# EAGLE schematic warp-revB (EAGLE 9.4.2)

## Sheet 1 of 2
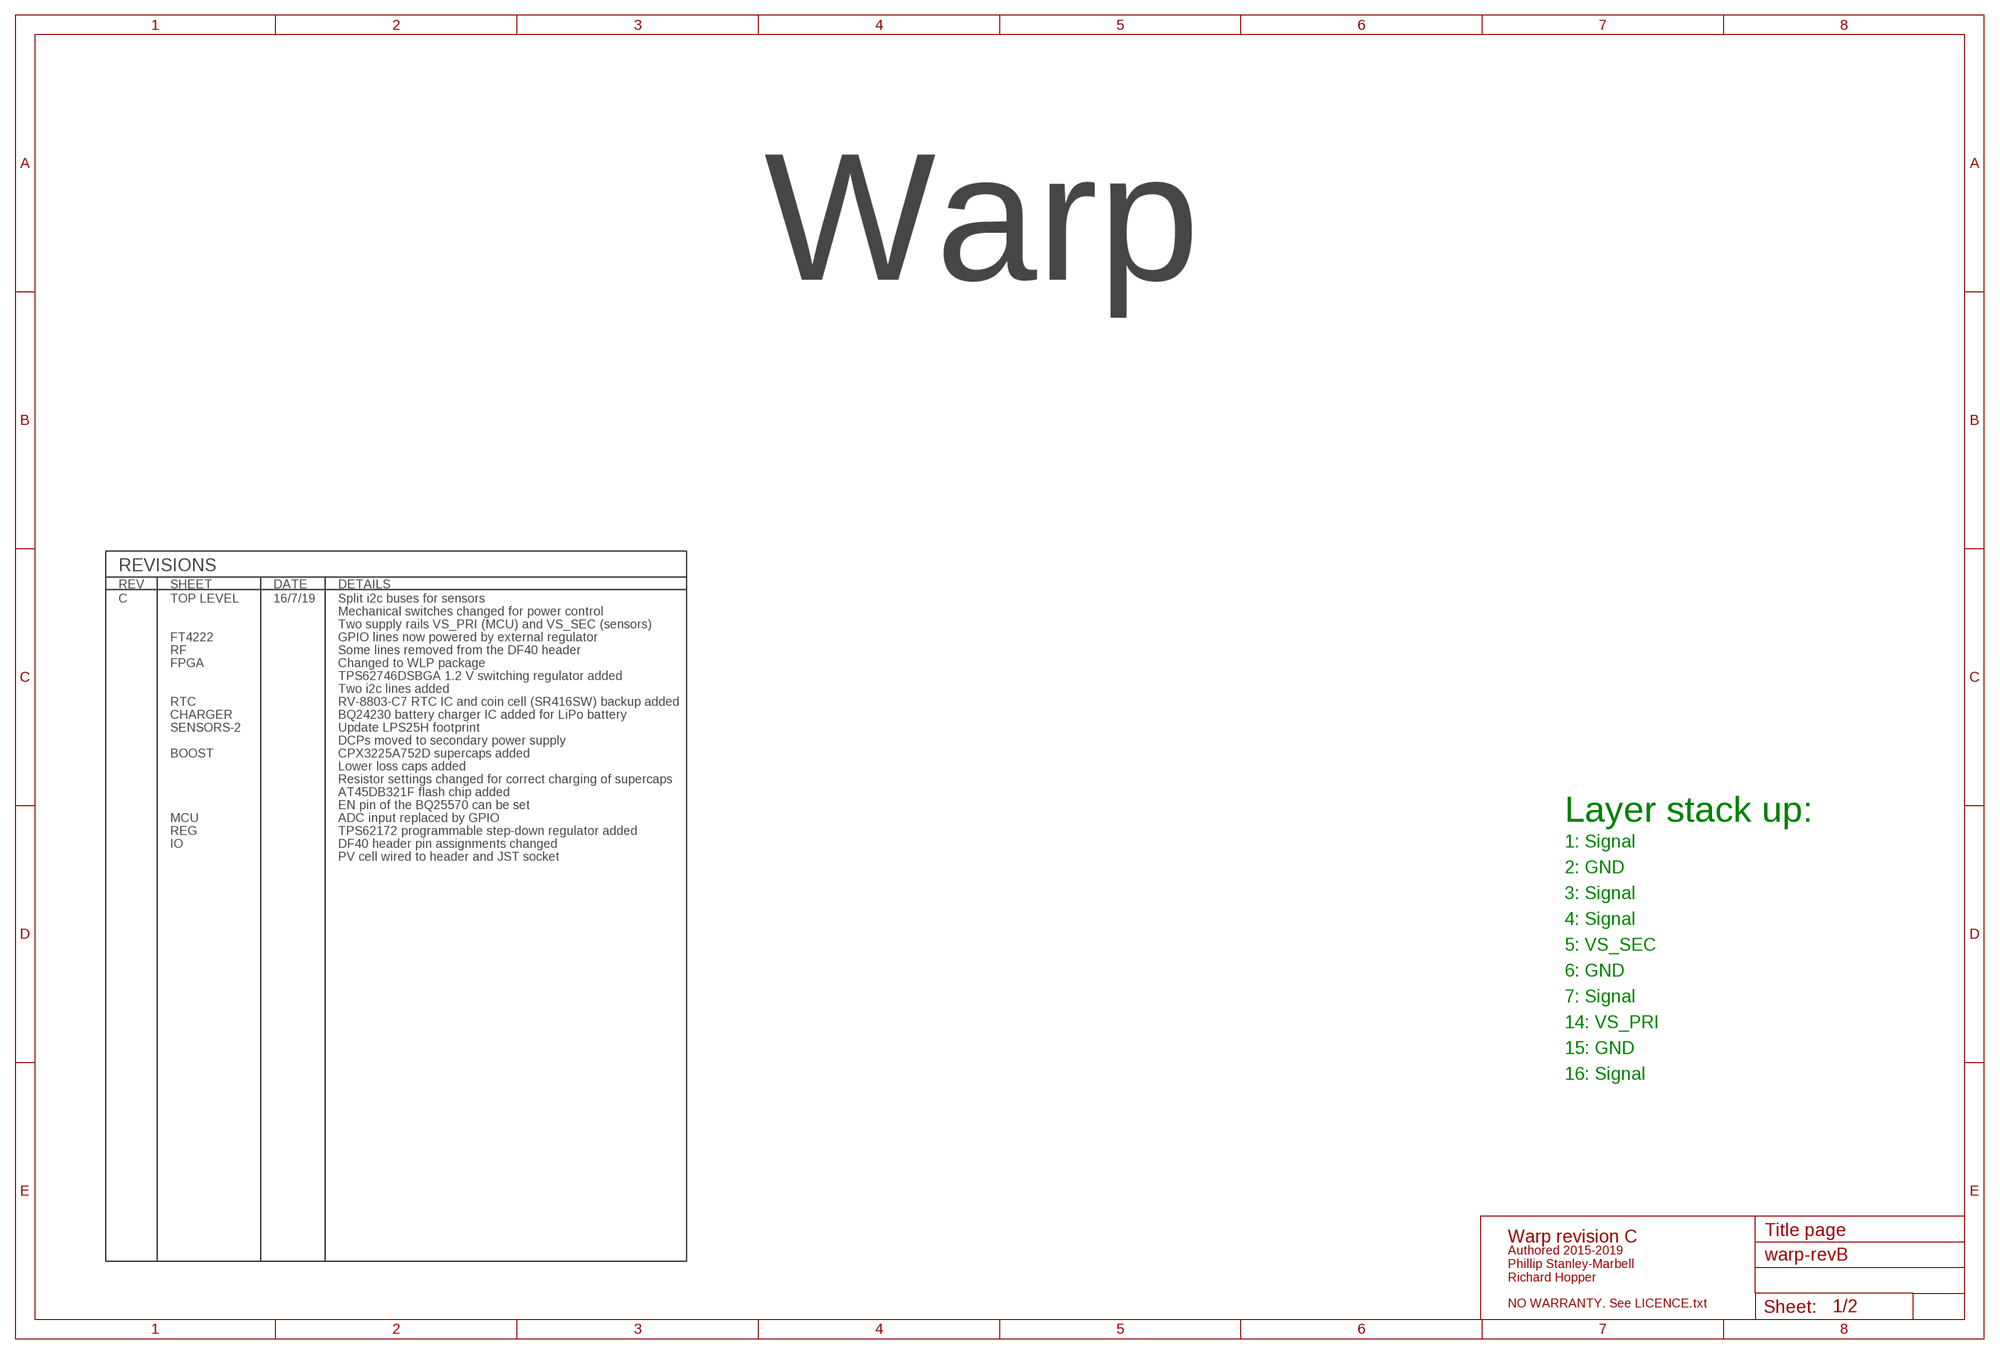
[diagram p0: schematic, sheet 1]

### Notes on the sheet
- Warp
- C | TOP LEVEL | 16/7/19 | Split i2c buses for sensors
- Mechanical switches changed for power control
- Two supply rails VS_PRI (MCU) and VS_SEC (sensors)
- FT4222 | GPIO lines now powered by external regulator
- RF | Some lines removed from the DF40 header
- FPGA | Changed to WLP package
- TPS62746DSBGA 1.2 V switching regulator added
- Two i2c lines added
- RTC | RV-8803-C7 RTC IC and coin cell (SR416SW) backup added
- CHARGER | BQ24230 battery charger IC added for LiPo battery
- SENSORS-2 | Update LPS25H footprint
- DCPs moved to secondary power supply
- BOOST | CPX3225A752D supercaps added
- Lower loss caps added
- Resistor settings changed for correct charging of supercaps
- AT45DB321F flash chip added
- EN pin of the BQ25570 can be set
- MCU | ADC input replaced by GPIO | Layer stack up:
- REG | TPS62172 programmable step-down regulator added
- IO | DF40 header pin assignments changed | 1: Signal
- PV cell wired to header and JST socket
- 2: GND
- 3: Signal
- 4: Signal
- 5: VS_SEC
- 6: GND
- 7: Signal
- 14: VS_PRI
- 15: GND
- 16: Signal
- Title page
- Warp revision C
- Authored 2015-2019
  Phillip Stanley-Marbell
  Richard Hopper
- NO WARRANTY. See LICENCE.txt

## Sheet 2 of 2
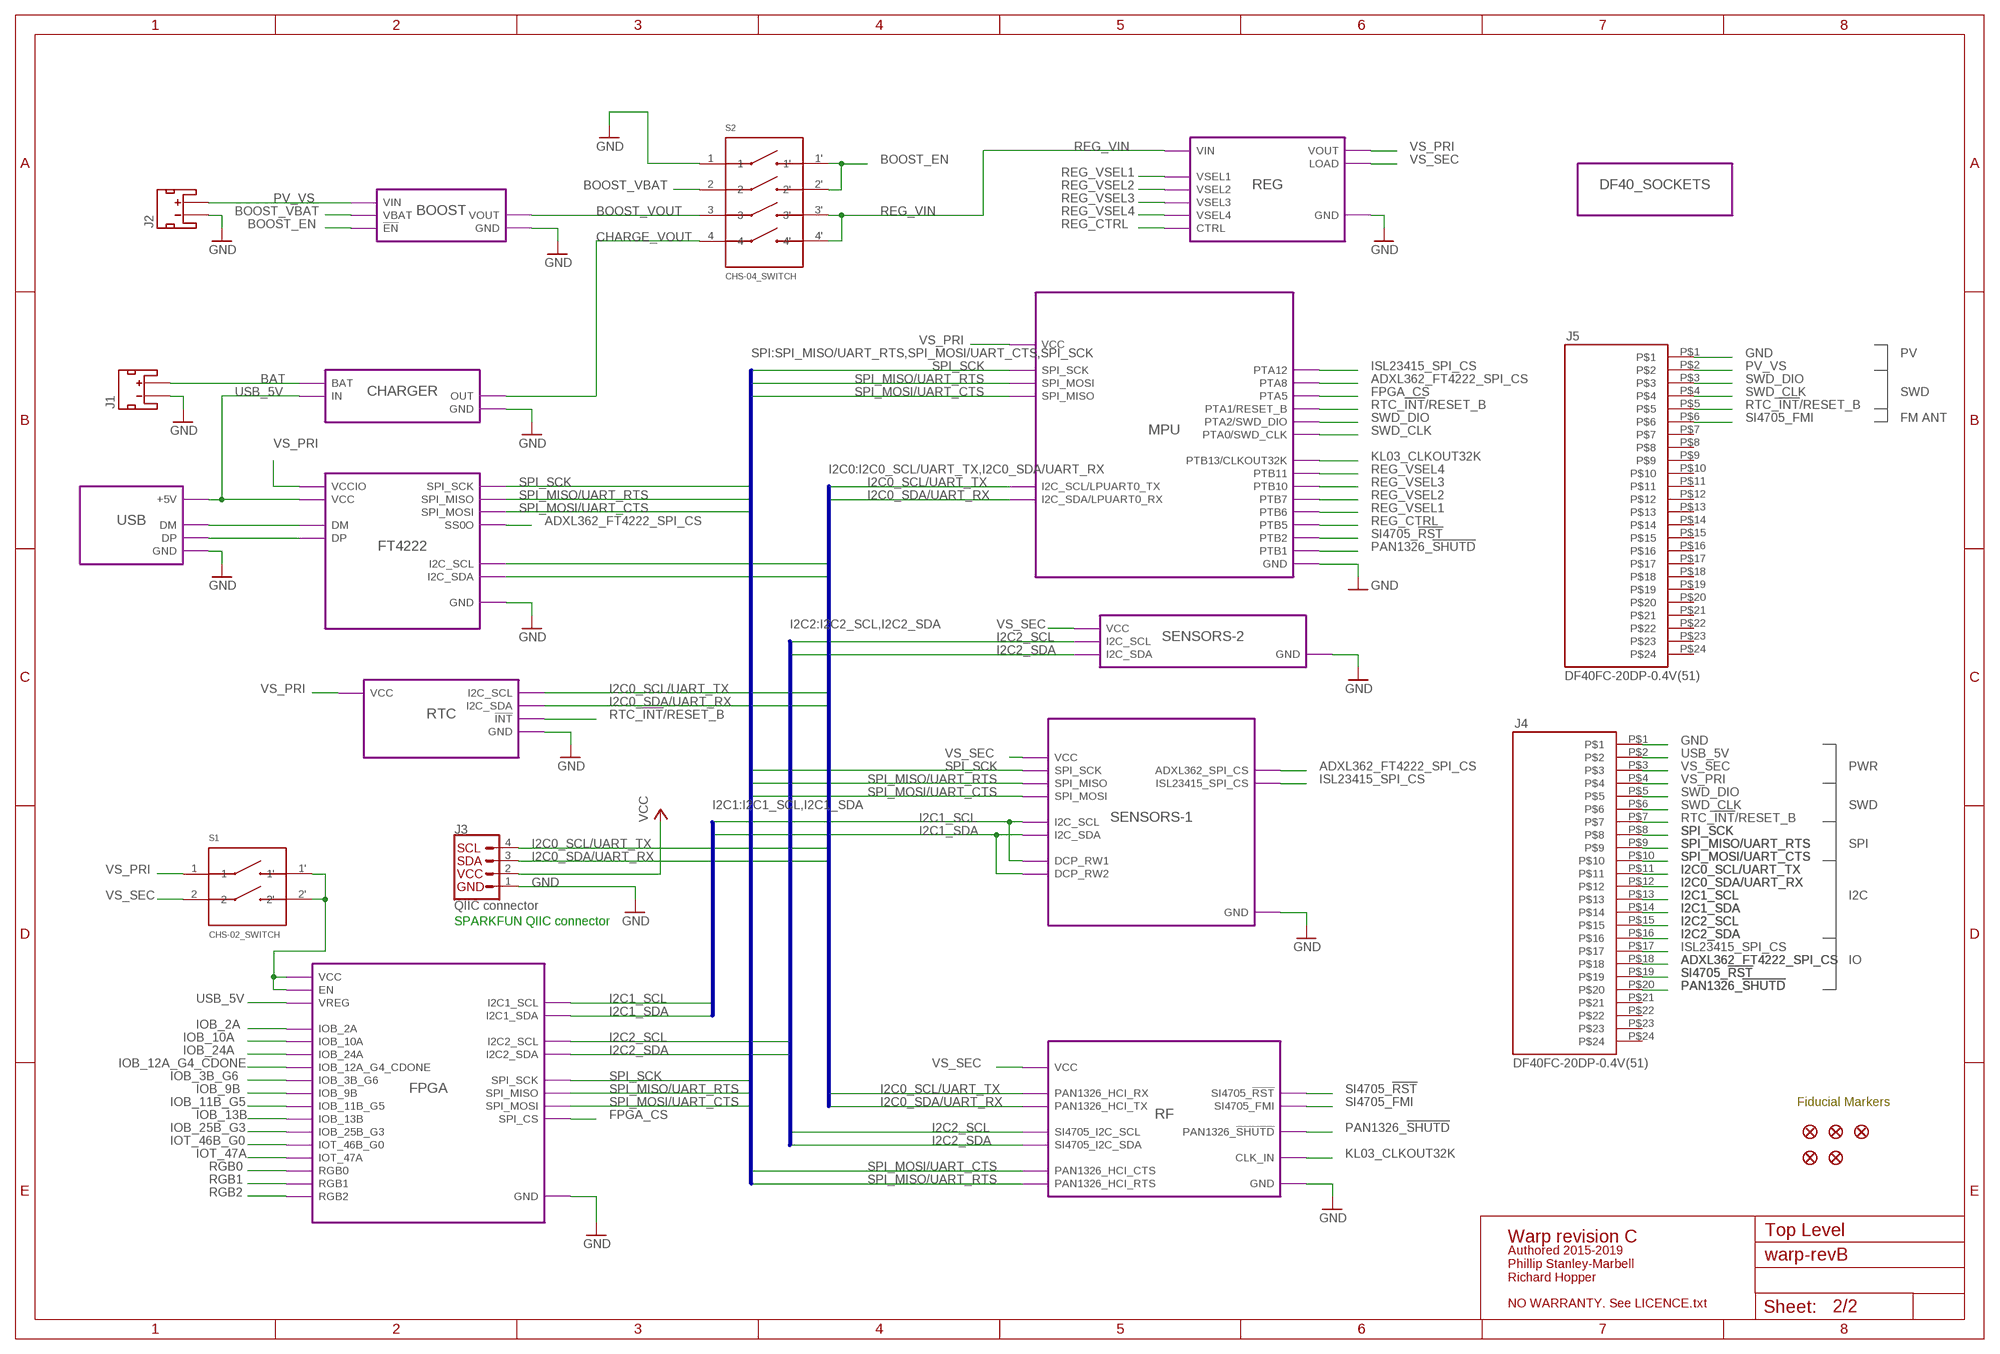
[diagram p1: schematic, sheet 2]

### Parts
FD1  FIDUCIAL1X2  [FIDUCIAL-1X2]
FD2  FIDUCIAL1X2  [FIDUCIAL-1X2]
FD3  FIDUCIAL1X2  [FIDUCIAL-1X2]
FD4  FIDUCIAL1X2  [FIDUCIAL-1X2]
FD5  FIDUCIAL1X2  [FIDUCIAL-1X2]
J1  JST_2MM_MALE  [JST-2-SMD]
J2  JST_2MM_MALE  [JST-2-SMD]
J3  QIIC connector  I2C_STANDARDJS-1MM  [1X04_1MM_RA]
J4  DF40FC-20DP-0.4V(51)  [DF40C-20DP-0.4V(51)]
J5  DF40FC-20DP-0.4V(51)  [DF40C-20DP-0.4V(51)]
S1  CHS-02_SWITCH  [CHS-02_SWITCH]
S2  CHS-04_SWITCH  [CHS-04_SWITCH]

### Module instances
BOOST = BOOSTER
MPU = MPU
REG = REG
RF = RF
SENSORS-1 = SENSORS-1
USB = USB
FPGA = FPGA
SENSORS-2 = SENSORS-2
RTC = RTC
CHARGER = CHARGER
FT4222 = FT4222
DF40_SOCKETS = DF40_SOCKETS

### Nets
ADXL362_FT4222_SPI_CS: J4.P$18 ; port SENSORS-1.ADXL362_SPI_CS MPU.PTA8 FT4222.SS0O
BAT: J1.2(+) ; port CHARGER.BAT
BOOST_EN: S2.1' S2.2' ; port BOOST.!EN!
BOOST_VBAT: S2.2 ; port BOOST.VBAT
BOOST_VOUT: S2.3 ; port BOOST.VOUT
CHARGE_VOUT: S2.4 ; port CHARGER.OUT
FPGA_CS: port FPGA.SPI_CS MPU.PTA5
FPGA_VS: S1.1' S1.2' ; port FPGA.VCC FPGA.EN
GND: J1.1(-) J2.1(-) J3.1(GND) J4.P$1 J5.P$1 S2.1 ; port REG.GND BOOST.GND USB.GND MPU.GND SENSORS-1.GND SENSORS-2.GND FPGA.GND RF.GND RTC.GND CHARGER.GND FT4222.GND
I2C0_SCL/UART_TX: J3.4(SCL) J4.P$11 ; port MPU.I2C_SCL/LPUART0_TX RTC.I2C_SCL RF.PAN1326_HCI_RX FT4222.I2C_SCL
I2C0_SDA/UART_RX: J3.3(SDA) J4.P$12 ; port MPU.I2C_SDA/LPUART0_RX RTC.I2C_SDA RF.PAN1326_HCI_TX FT4222.I2C_SDA
I2C1_SCL: J4.P$13 ; port FPGA.I2C1_SCL SENSORS-1.I2C_SCL SENSORS-1.DCP_RW1
I2C1_SDA: J4.P$14 ; port FPGA.I2C1_SDA SENSORS-1.I2C_SDA SENSORS-1.DCP_RW2
I2C2_SCL: J4.P$15 ; port FPGA.I2C2_SCL SENSORS-2.I2C_SCL RF.SI4705_I2C_SCL
I2C2_SDA: J4.P$16 ; port FPGA.I2C2_SDA SENSORS-2.I2C_SDA RF.SI4705_I2C_SDA
IOB_2A: port FPGA.IOB_2A
IOB_3B_G6: port FPGA.IOB_3B_G6
IOB_9B: port FPGA.IOB_9B
IOB_10A: port FPGA.IOB_10A
IOB_11B_G5: port FPGA.IOB_11B_G5
IOB_12A_G4_CDONE: port FPGA.IOB_12A_G4_CDONE
IOB_13B: port FPGA.IOB_13B
IOB_24A: port FPGA.IOB_24A
IOB_25B_G3: port FPGA.IOB_25B_G3
IOT_46B_G0: port FPGA.IOT_46B_G0
IOT_47A: port FPGA.IOT_47A
ISL23415_SPI_CS: J4.P$17 ; port SENSORS-1.ISL23415_SPI_CS MPU.PTA12
KL03_CLKOUT32K: port MPU.PTB13/CLKOUT32K RF.CLK_IN
N$1: port USB.DP FT4222.DP
N$2: port USB.DM FT4222.DM
PAN1326_!SHUTD: J4.P$20 ; port RF.PAN1326_!SHUTD! MPU.PTB1
PV_VS: J2.2(+) J5.P$2 ; port BOOST.VIN
REG_CTRL: port REG.CTRL MPU.PTB5
REG_VIN: S2.3' S2.4' ; port REG.VIN
REG_VSEL1: port REG.VSEL1 MPU.PTB6
REG_VSEL2: port REG.VSEL2 MPU.PTB7
REG_VSEL3: port REG.VSEL3 MPU.PTB10
REG_VSEL4: port REG.VSEL4 MPU.PTB11
RGB0: port FPGA.RGB0
RGB1: port FPGA.RGB1
RGB2: port FPGA.RGB2
RTC_!INT!/RESET_B: J4.P$7 J5.P$5 ; port MPU.PTA1/RESET_B RTC.!INT
SI4705_!RST!: J4.P$19 ; port RF.SI4705_!RST MPU.PTB2
SI4705_FMI: J5.P$6 ; port RF.SI4705_FMI
SPI_MISO/UART_RTS: J4.P$9 ; port MPU.SPI_MOSI SENSORS-1.SPI_MISO FPGA.SPI_MISO RF.PAN1326_HCI_RTS FT4222.SPI_MISO
SPI_MOSI/UART_CTS: J4.P$10 ; port SENSORS-1.SPI_MOSI MPU.SPI_MISO FPGA.SPI_MOSI RF.PAN1326_HCI_CTS FT4222.SPI_MOSI
SPI_SCK: J4.P$8 ; port MPU.SPI_SCK SENSORS-1.SPI_SCK FPGA.SPI_SCK FT4222.SPI_SCK
SWD_CLK: J4.P$6 J5.P$4 ; port MPU.PTA0/SWD_CLK
SWD_DIO: J4.P$5 J5.P$3 ; port MPU.PTA2/SWD_DIO
USB_5V: J4.P$2 ; port CHARGER.IN USB.+5V FT4222.VCC FPGA.VREG
VCC: J3.2(VCC)
VS_PRI: J4.P$4 S1.1 ; port MPU.VCC REG.VOUT RTC.VCC FT4222.VCCIO
VS_SEC: J4.P$3 S1.2 ; port SENSORS-1.VCC RF.VCC REG.LOAD SENSORS-2.VCC
Unconnected: J1.NC1(PAD1) J1.NC2(PAD2) J2.NC1(PAD1) J2.NC2(PAD2) J4.P$21 J4.P$22 J4.P$23 J4.P$24 J5.P$7 J5.P$8 J5.P$9 J5.P$10 J5.P$11 J5.P$12 J5.P$13 J5.P$14 J5.P$15 J5.P$16 J5.P$17 J5.P$18 J5.P$19 J5.P$20 J5.P$21 J5.P$22 J5.P$23 J5.P$24

### Buses
SPI:SPI_MISO/UART_RTS,SPI_MOSI/UART_CTS,SPI_SCK
I2C1:I2C1_SCL,I2C1_SDA
I2C2:I2C2_SCL,I2C2_SDA
I2C0:I2C0_SCL/UART_TX,I2C0_SDA/UART_RX

### Notes on the sheet
- PV
- SWD
- FM ANT
- PWR
- SWD
- SPI
- I2C
- SPARKFUN QIIC connector
- IO
- Fiducial Markers
- Top Level
- Warp revision C
- Authored 2015-2019
  Phillip Stanley-Marbell
  Richard Hopper
- NO WARRANTY. See LICENCE.txt

## Library data of the parts
FD1-FD5 = SparkFun-Aesthetics:FIDUCIAL: Fiducial Alignment Points Point-of-reference for pick-and-place machines and other optical instruments.
J1 J2 = SparkFun-Connectors:JST_2MM_MALE: JST 2MM MALE RA CONNECTOR Two pin, compact surface mount connector. Commonly used as a battery input connection point. We really like the solid locking feeling and high current rating on these small connectors. We use these all the time as battery connectors. Mates to single-cell LiPo batteries. Here is the connector we sell at SparkFun: JST Right Angle Connector - White <https://www.sparkfun.com/products/8612> (PRT-08612) Datasheet <http://www.sparkfun.com/datasheets/Prototyping/Connectors/JST-Horizontal.pdf> It was used on these SparkFun products: SparkFun MOSFET Power Controller <https://www.sparkfun.com/products/11214> (PRT-11214) SparkFun Battery Babysitter - LiPo Battery Manager <https://www.sparkfun.com/products/13777> (PRT-13777) And many, many others that required a lipo battery connection.; PROD_ID: CONN-11443; SF_ID: PRT-08612
J3 = SparkX:I2C_STANDARD: SparkFun I2C Standard Pinout Header SparkFun has standardized on a pinout for all I2C based sensor breakouts. This pinout allows I2C boards to be plugged directly into the headers on Arduino Uno compatible boards, and to be daisy chained easily. Example SparkFun Products: SparkFun Atmospheric Sensor Breakout - BME280 <https://www.sparkfun.com/products/13676> SparkFun Altitude/Pressure Sensor Breakout - MPL3115A2 <https://www.sparkfun.com/products/11084> SparkFun TOF Range Finder Sensor - VL6180 <https://www.sparkfun.com/products/12785>
J4 J5 = DF40FC-20DP-0.4V(51):DF40FC-20DP-0.4V(51): DF40C-20DP-0.4V(51) Pins 21, 22, 23, and 24 (at the corners of the package) are not supposed to be used electrically. They have slightly wider pads. NOTE: The receptacles do not have connectors to the signals from these pins!
S1 = CHS_SWITCH:CHS-02_SWITCH
S2 = CHS_SWITCH:CHS-04_SWITCH

## Module BOOSTER
Ports: VIN(in) VOUT(out) !EN!(in) VBAT(pas) GND(pwr)
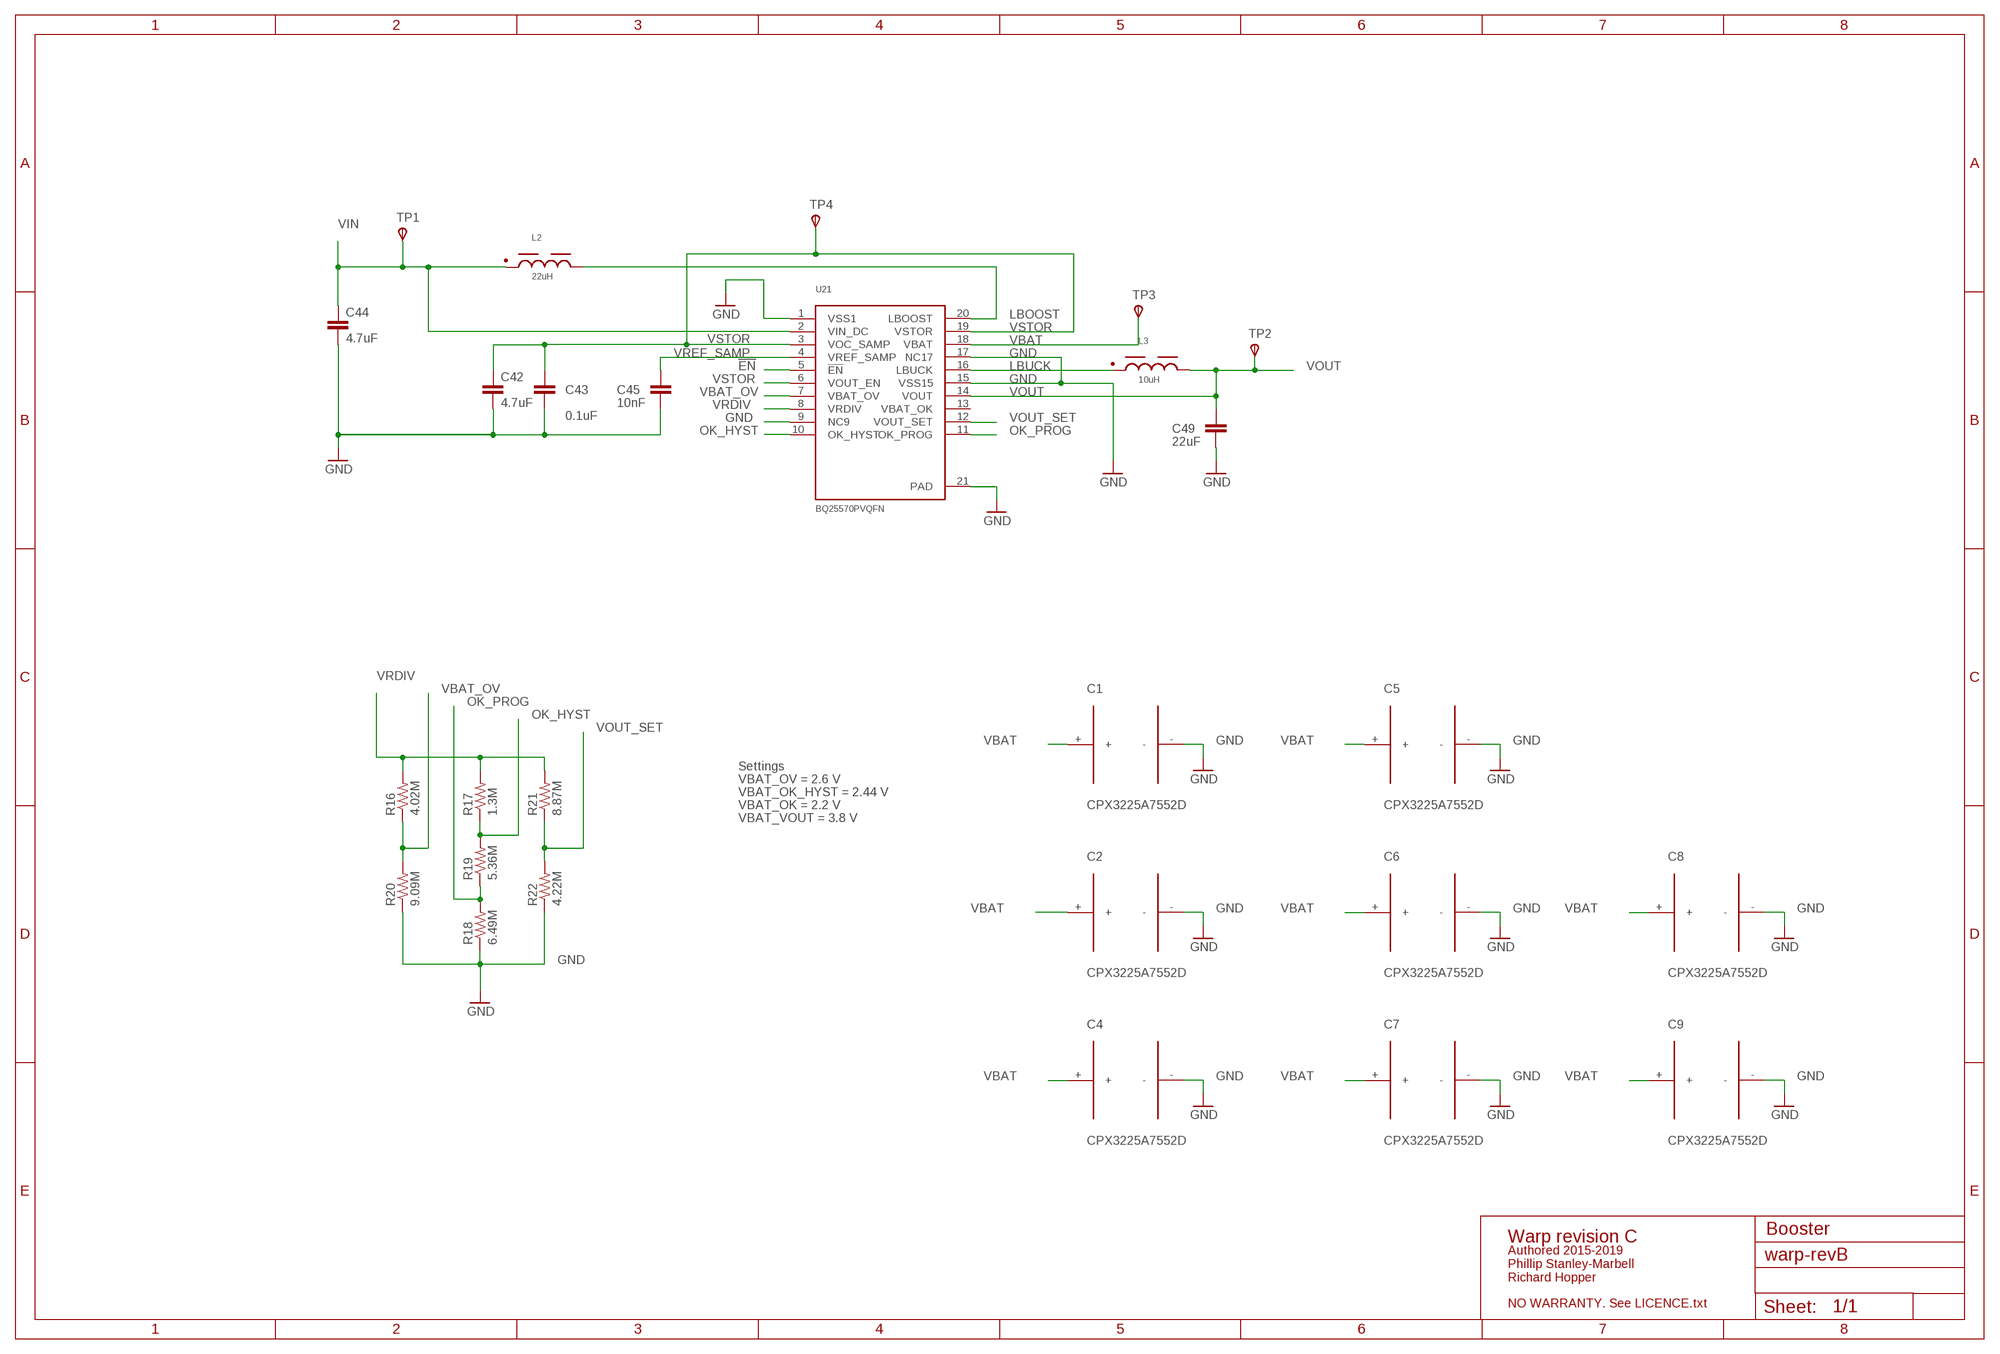
[diagram p2: schematic, module BOOSTER, sheet 1]

### Parts
C1  CPX3225A7552D  [CPX3225A752D]
C2  CPX3225A7552D  [CPX3225A752D]
C4  CPX3225A7552D  [CPX3225A752D]
C5  CPX3225A7552D  [CPX3225A752D]
C6  CPX3225A7552D  [CPX3225A752D]
C7  CPX3225A7552D  [CPX3225A752D]
C8  CPX3225A7552D  [CPX3225A752D]
C9  CPX3225A7552D  [CPX3225A752D]
C42  4.7uF  CAP0805  [0805]
C43  0.1uF  CAP0603-CAP  [0603-CAP]
C44  4.7uF  CAP0805  [0805]
C45  10nF  CAP0603-CAP  [0603-CAP]
C49  22uF  CAP0805  [0805]
L2  22uH  WE-TPC_3816_744031220  [WE-TPC_3816]
L3  10uH  WE-TPC_2813_744029100  [WE-TPC_2811/2813_OLD]
R16  4.02M  RESISTOR0402-RES  [0402-RES]
R17  1.3M  RESISTOR0402-RES  [0402-RES]
R18  6.49M  RESISTOR0402-RES  [0402-RES]
R19  5.36M  RESISTOR0402-RES  [0402-RES]
R20  9.09M  RESISTOR0402-RES  [0402-RES]
R21  8.87M  RESISTOR0402-RES  [0402-RES]
R22  4.22M  RESISTOR0402-RES  [0402-RES]
TP1  TPSTP06R  [TP06R]
TP2  TPSTP06R  [TP06R]
TP3  TPSTP06R  [TP06R]
TP4  TPSTP06R  [TP06R]
U21  BQ25570PVQFN  [BQ25570]

### Nets
!EN!: U21.5(!EN)
GND: C1.- C2.- C4.- C5.- C6.- C7.- C8.- C9.- C42.2 C43.2 C44.2 C45.2 C49.2 R18.1 R20.1 R22.1 U21.1(VSS1) U21.9(NC9) U21.15(VSS15) U21.17(NC17) U21.21(PAD)
LBOOST: L2.2 U21.20(LBOOST)
LBUCK: L3.1 U21.16(LBUCK)
OK_HYST: R17.1 R19.2 U21.10(OK_HYST)
OK_PROG: R18.2 R19.1 U21.11(OK_PROG)
VBAT: C1.+ C2.+ C4.+ C5.+ C6.+ C7.+ C8.+ C9.+ TP3.TP(PP) U21.18(VBAT)
VBAT_OV: R16.1 R20.2 U21.7(VBAT_OV)
VIN: C44.1 L2.1 TP1.TP(PP) U21.2(VIN_DC)
VOUT: C49.1 L3.2 TP2.TP(PP) U21.14(VOUT)
VOUT_SET: R21.1 R22.2 U21.12(VOUT_SET)
VRDIV: R16.2 R17.2 R21.2 U21.8(VRDIV)
VREF_SAMP: C45.1 U21.4(VREF_SAMP)
VSTOR: C42.1 C43.1 TP4.TP(PP) U21.3(VOC_SAMP) U21.6(VOUT_EN) U21.19(VSTOR)
Unconnected: U21.13(VBAT_OK)

### Notes on the sheet
- Settings
- VBAT_OV = 2.6 V
- VBAT_OK_HYST = 2.44 V
- VBAT_OK = 2.2 V
- VBAT_VOUT = 3.8 V
- Booster
- Warp revision C
- Authored 2015-2019
  Phillip Stanley-Marbell
  Richard Hopper
- NO WARRANTY. See LICENCE.txt

### Library data of the parts
C1 C2 C4-C8 = CPX3225A752D:CPX3225A7552D: CPX3225A eectric double layer capacitor
C9 = CPX3225A752D:CPX3225A7552D: CPX3225A eectric double layer capacitor; SPICEPREFIX: C
C42 C44 = SparkFun-Passives:CAP: Capacitor Standard 0603 ceramic capacitor, and 0.1" leaded capacitor.; PN: C0805C475K9RACTU
C43 = SparkFun-Passives:CAP: Capacitor Standard 0603 ceramic capacitor, and 0.1" leaded capacitor.; PN: 02016D104KAT2A
C45 = SparkFun-Passives:CAP: Capacitor Standard 0603 ceramic capacitor, and 0.1" leaded capacitor.; PN: GRM188R71H103KA01D
C49 = SparkFun-Passives:CAP: Capacitor Standard 0603 ceramic capacitor, and 0.1" leaded capacitor.; PN: JMK212BJ226KG-T
L2 = EMCComponents (rev19c):WE-TPC_3816: SMD Shielded Tiny Power Inductor Characteristics Extremely flat power inductor High current capability Magnetically shielded which results in a low leakage field Operating temperature: –40 °C to +125 °C Applications Portable power like PDA, digital camera, PCMCIA cards and displays DC/DC converter Embedded PC Mobile data gathering, telemetric <http://katalog.we-online.de/media/images/v2/WE-TPC_Gruppe_2.jpg> Details see: http://katalog.we-online.de/en/pbs/WE-TPC? Updated by Dan Xu 2014-07-11 2014 (C) Wurth Elektronik; WE-NUMBER: 744031220/22uH
L3 = EMCComponents (rev19c):WE-TPC_2813: SMD Shielded Tiny Power Inductor Characteristics Extremely flat power inductor High current capability Magnetically shielded which results in a low leakage field Operating temperature: –40 °C to +125 °C Applications Portable power like PDA, digital camera, PCMCIA cards and displays DC/DC converter Embedded PC Mobile data gathering, telemetric <http://katalog.we-online.de/media/images/v2/WE-TPC_Gruppe_2.jpg> Details see: http://katalog.we-online.de/en/pbs/WE-TPC? Updated by Dan Xu 2014-07-11 2014 (C) Wurth Elektronik; WE-NUMBER: 744029100/10uH
R16-R22 = SparkFun-Passives:RESISTOR: Resistor Basic schematic elements and footprints for 0603, 1206, and PTH resistors.
TP1-TP4 = testpad:TPS: TEST PIN
U21 = BQ25570:BQ25570

## Module MPU
Ports: GND(pwr) VCC(io) PTB1(io) PTB2(io) PTB5(io) PTB6(io) PTB7(io) PTA8(io) PTA5(io) PTB10(io) PTA12(io) PTB11(io) PTB13/CLKOUT32K(io) SPI_SCK(out) SPI_MISO(in) SPI_MOSI(out) I2C_SCL/LPUART0_TX(out) I2C_SDA/LPUART0_RX(io) PTA1/RESET_B(io) PTA2/SWD_DIO(io) PTA0/SWD_CLK(io)
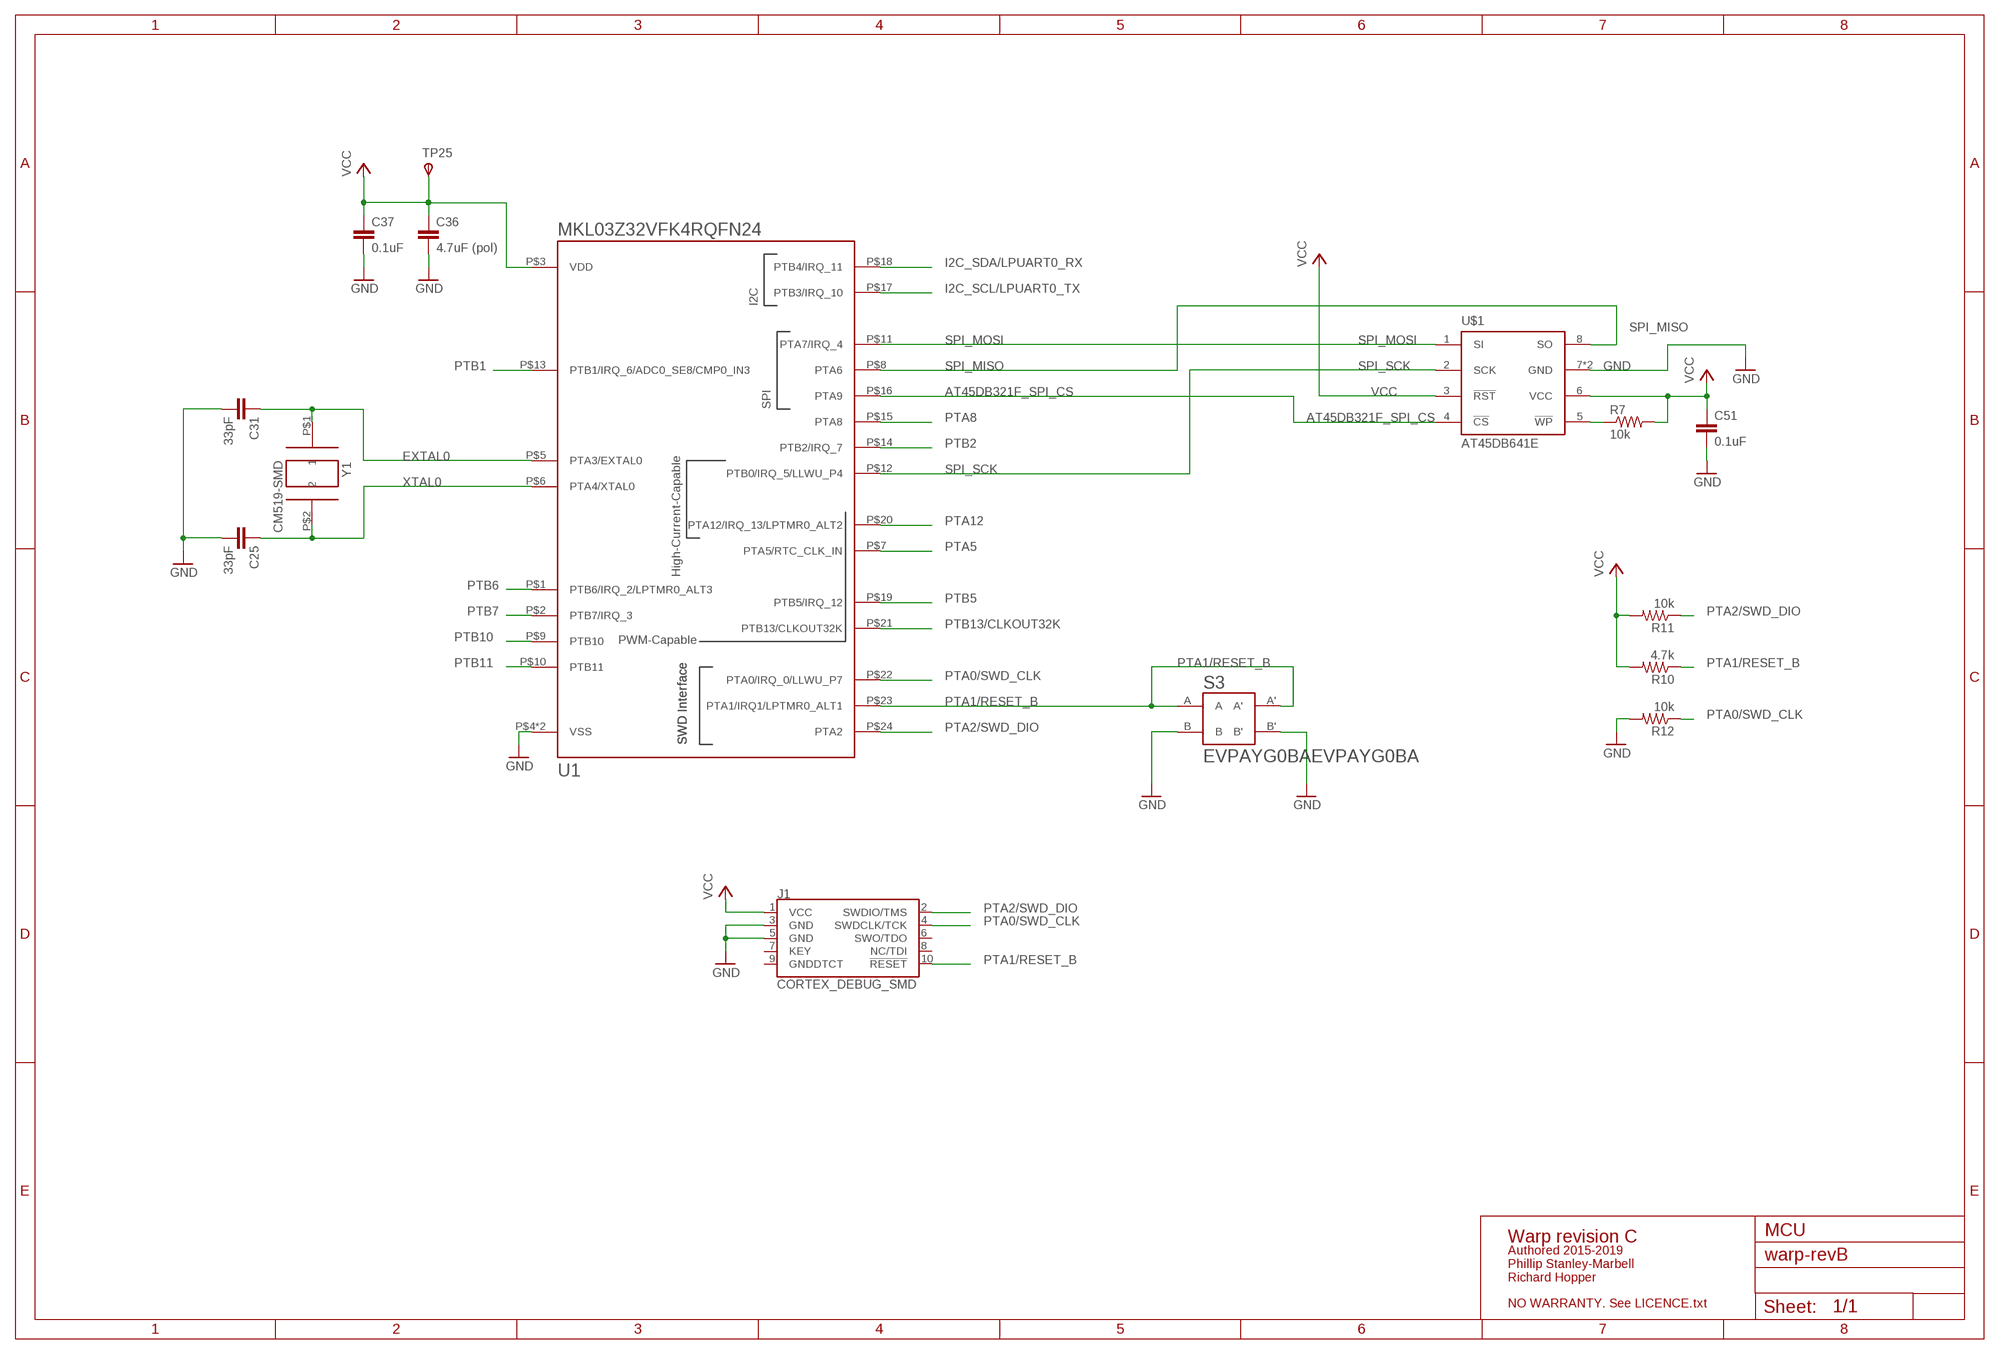
[diagram p3: schematic, module MPU, sheet 1]

### Parts
C25  33pF  CAP0402-CAP  [0402-CAP]
C31  33pF  CAP0402-CAP  [0402-CAP]
C36  4.7uF (pol)  CAP0402-CAP  [0402-CAP]
C37  0.1uF  CAP0402-CAP  [0402-CAP]
C51  0.1uF  CAP0402-CAP  [0402-CAP]
J1  CORTEX_DEBUG_SMD  [SAMTECH_FTSH-105-01]
R7  10k  RESISTOR0402-RES  [0402-RES]
R10  4.7k  RESISTOR0402-RES  [0402-RES]
R11  10k  RESISTOR0402-RES  [0402-RES]
R12  10k  RESISTOR0402-RES  [0402-RES]
S3  EVPAYG0BAEVPAYG0BA  [EVPAYG0BA]
TP25  TPSTP06R  [TP06R]
U1  MKL03Z32VFK4RQFN24  [MKL03Z32VFK4R]
U$1  AT45DB641E  [UDFN]
Y1  CM519-SMD  [CM519]

### Nets
AT45DB321F_SPI_CS: U1.P$16(PTA9) U$1.4(!CS!)
EXTAL0: C31.1 U1.P$5(PTA3/EXTAL0) Y1.P$1
GND: C25.2 C31.2 C51.2 J1.3(GND) J1.5(GND) R12.2 S3.B S3.B' U1.P$4(VSS) U1.P$PAD(VSS) U$1.7(GND) U$1.9(GND)
I2C_SCL/LPUART0_TX: U1.P$17(PTB3/IRQ_10)
I2C_SDA/LPUART0_RX: U1.P$18(PTB4/IRQ_11)
N$4: R7.1 U$1.5(!WP!)
N$5: C37.2 ; supply symbol labelled GND
N$6: C36.2 ; supply symbol labelled GND
PTA0/SWD_CLK: J1.4(SWDCLK/TCK) R12.1 U1.P$22(PTA0/IRQ_0/LLWU_P7)
PTA1/RESET_B: J1.10(!RESET) R10.1 S3.A S3.A' U1.P$23(PTA1/IRQ1/LPTMR0_ALT1)
PTA2/SWD_DIO: J1.2(SWDIO/TMS) R11.1 U1.P$24(PTA2)
PTA5: U1.P$7(PTA5/RTC_CLK_IN)
PTA8: U1.P$15(PTA8)
PTA12: U1.P$20(PTA12/IRQ_13/LPTMR0_ALT2)
PTB1: U1.P$13(PTB1/IRQ_6/ADC0_SE8/CMP0_IN3)
PTB2: U1.P$14(PTB2/IRQ_7)
PTB5: U1.P$19(PTB5/IRQ_12)
PTB6: U1.P$1(PTB6/IRQ_2/LPTMR0_ALT3)
PTB7: U1.P$2(PTB7/IRQ_3)
PTB10: U1.P$9(PTB10)
PTB11: U1.P$10(PTB11)
PTB13/CLKOUT32K: U1.P$21(PTB13/CLKOUT32K)
SPI_MISO: U1.P$8(PTA6) U$1.8(SO)
SPI_MOSI: U1.P$11(PTA7/IRQ_4) U$1.1(SI)
SPI_SCK: U1.P$12(PTB0/IRQ_5/LLWU_P4) U$1.2(SCK)
VCC: C36.1 C37.1 C51.1 J1.1(VCC) R7.2 R10.2 R11.2 TP25.TP(PP) U1.P$3(VDD) U$1.3(!RST!) U$1.6(VCC)
XTAL0: C25.1 U1.P$6(PTA4/XTAL0) Y1.P$2
Unconnected: J1.6(SWO/TDO) J1.7(KEY) J1.8(NC/TDI) J1.9(GNDDTCT)

### Notes on the sheet
- MCU
- Warp revision C
- Authored 2015-2019
  Phillip Stanley-Marbell
  Richard Hopper
- NO WARRANTY. See LICENCE.txt

### Library data of the parts
C25 C31 C36 C37 C51 = SparkFun-Passives:CAP: Capacitor Standard 0603 ceramic capacitor, and 0.1" leaded capacitor.
J1 = SparkFun-Connectors:CORTEX_DEBUG: Cortex Debug Connector - 10 pin Supports JTAG debug, Serial Wire debug, and Serial Wire Viewer. PTH and SMD connector options available. General Connector Information <http://infocenter.arm.com/help/topic/com.arm.doc.faqs/attached/13634/cortex_debug_connectors.pdf> Products: PTH Connector <http://www.digikey.com/product-detail/en/cnc-tech/3220-10-0100-00/1175-1627-ND/3883661> -via Digi-Key SparkFun PSoc <https://www.sparkfun.com/products/13229> SparkFun T <https://www.sparkfun.com/products/13810>
R7 R10-R12 = SparkFun-Passives:RESISTOR: Resistor Basic schematic elements and footprints for 0603, 1206, and PTH resistors.
S3 = EVPAYG0BA:EVPAYG0BA
TP25 = testpad:TPS: TEST PIN
U1 = MKL03Z32VFK4R:MKL03Z32VFK4R: Kinetis KL03 32 KB Flash, 48 MHz Cortex-M0+ Microcontroller, in 24 pin QFN package (MKL03Z32VFK4R). The package for the 20 pin WLCSP (MKL03Z32CAF4R) is also in the library due to historical reasons. Can't yet figure out how to remove it.
U$1 = AT45D_Flash:AT45DB641E: 64-Mbit DataFlash (with Extra 2-Mbits), 1.7V Minimum SPI Serial Flash Memory
Y1 = CM519:CM519

## Module REG
Ports: GND(pwr) VIN(pwr) VOUT(pwr) LOAD(pwr) CTRL(in) VSEL1(in) VSEL2(in) VSEL3(in) VSEL4(in)
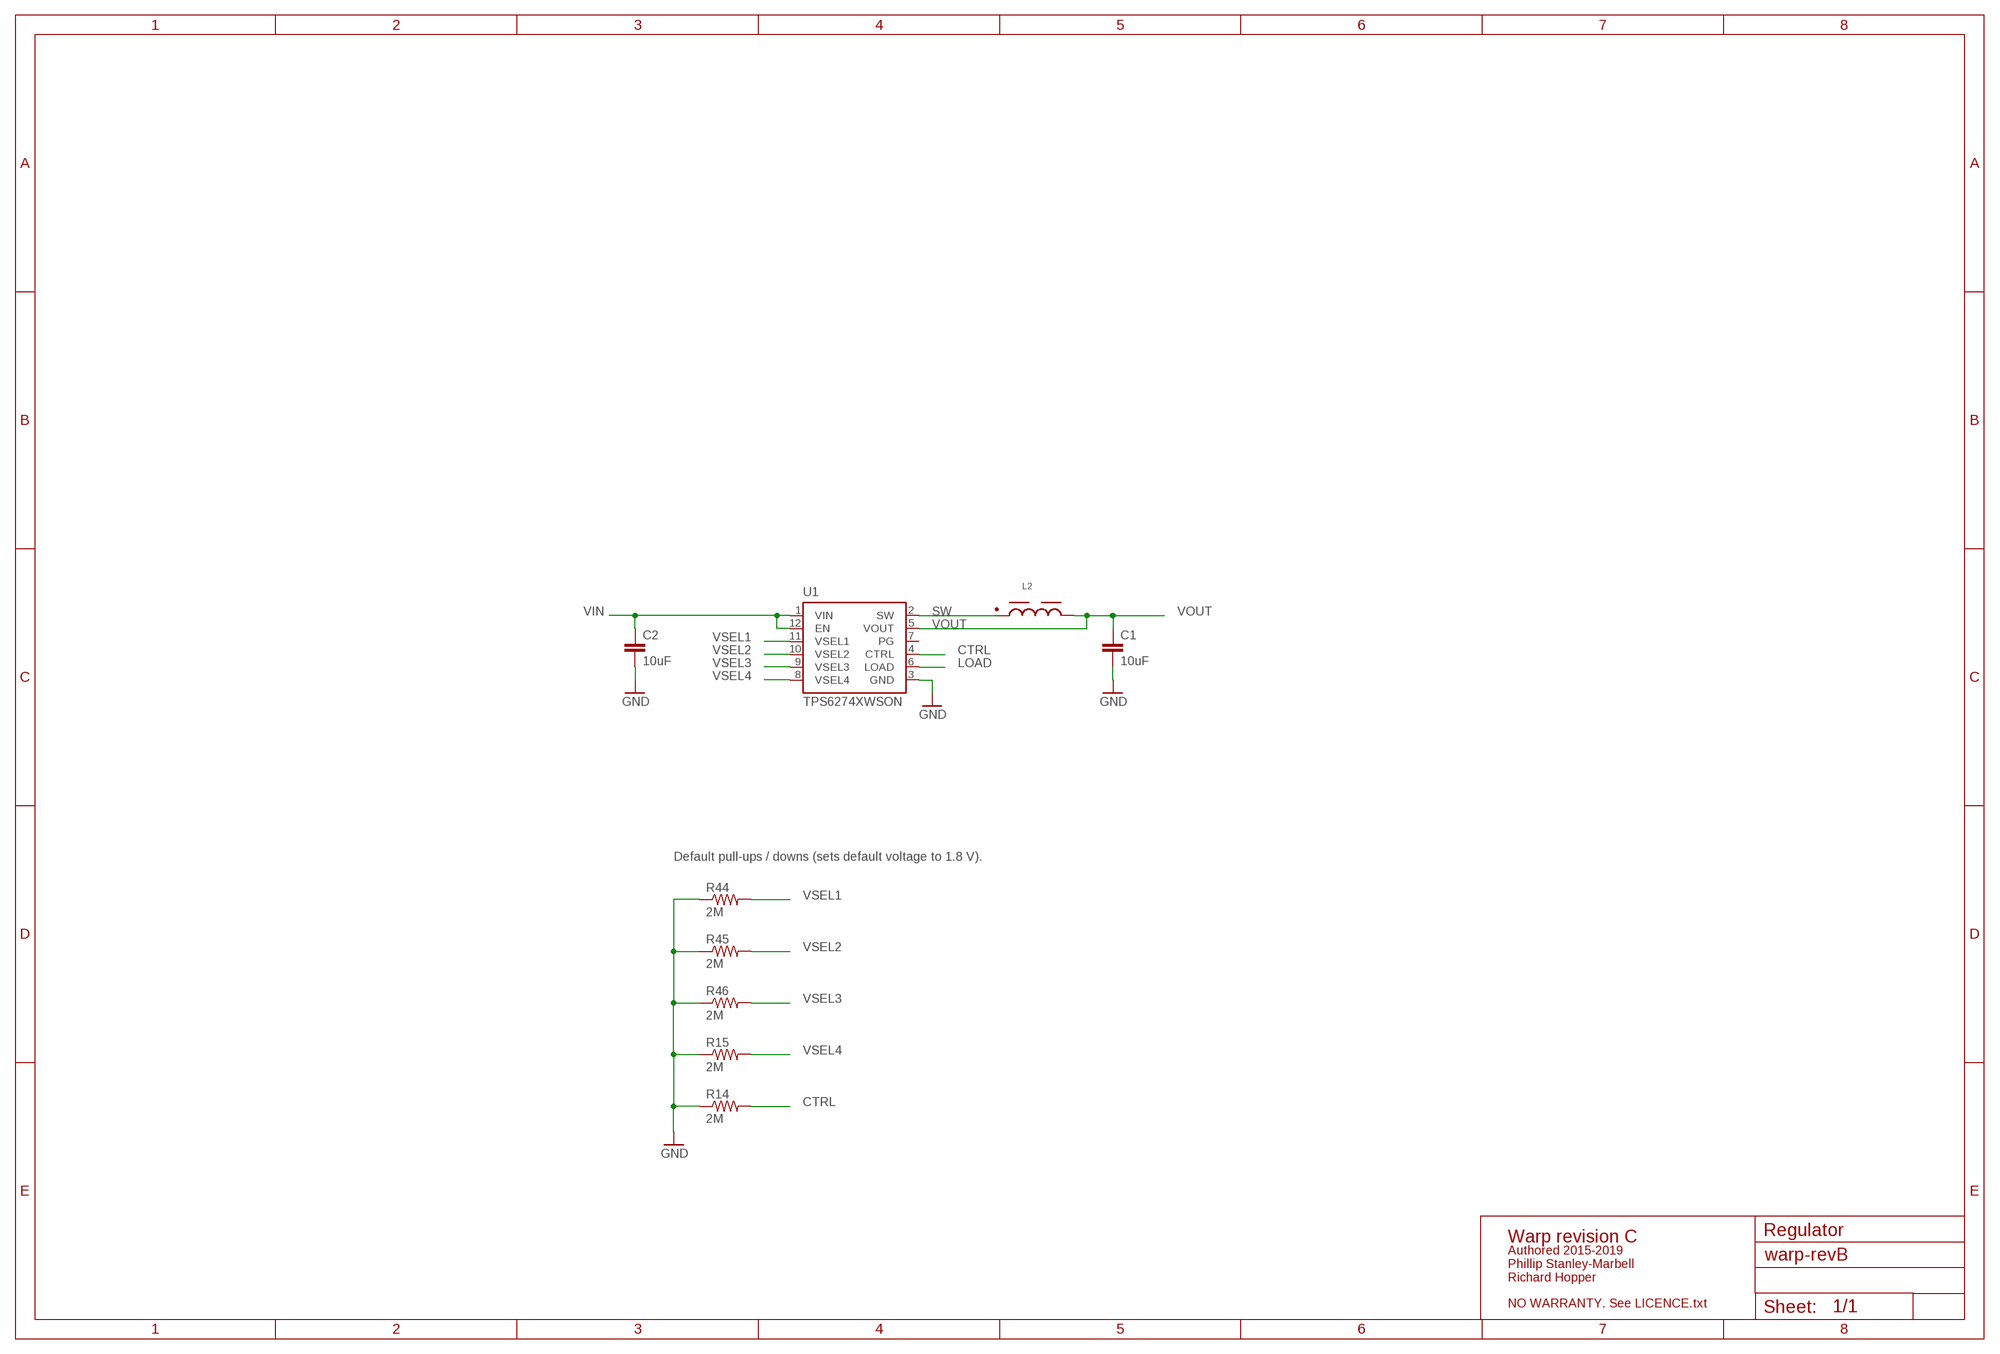
[diagram p4: schematic, module REG, sheet 1]

### Parts
C1  10uF  CAP0805  [0805]
C2  10uF  CAP0805  [0805]
L2  WE-TPC_2828_744025002  [WE-TPC_2828_OLD]
R14  2M  RESISTOR0402-RES  [0402-RES]
R15  2M  RESISTOR0402-RES  [0402-RES]
R44  2M  RESISTOR0402-RES  [0402-RES]
R45  2M  RESISTOR0402-RES  [0402-RES]
R46  2M  RESISTOR0402-RES  [0402-RES]
U1  TPS6274XWSON  [WSON-12]

### Nets
CTRL: R14.2 U1.4(CTRL)
GND: C1.2 C2.2 R14.1 R15.1 R44.1 R45.1 R46.1 U1.3(GND)
LOAD: U1.6(LOAD)
SW: L2.1 U1.2(SW)
VIN: C2.1 U1.1(VIN) U1.12(EN)
VOUT: C1.1 L2.2 U1.5(VOUT)
VSEL1: R44.2 U1.11(VSEL1)
VSEL2: R45.2 U1.10(VSEL2)
VSEL3: R46.2 U1.9(VSEL3)
VSEL4: R15.2 U1.8(VSEL4)
Unconnected: U1.7(PG)

### Notes on the sheet
- Default pull-ups / downs (sets default voltage to 1.8 V).
- Regulator
- Warp revision C
- Authored 2015-2019
  Phillip Stanley-Marbell
  Richard Hopper
- NO WARRANTY. See LICENCE.txt

### Library data of the parts
C1 C2 = SparkFun-Passives:CAP: Capacitor Standard 0603 ceramic capacitor, and 0.1" leaded capacitor.
L2 = EMCComponents (rev19c):WE-TPC_2828: SMD Shielded Tiny Power Inductor Characteristics Extremely flat power inductor High current capability Magnetically shielded which results in a low leakage field Operating temperature: –40 °C to +125 °C Applications Portable power like PDA, digital camera, PCMCIA cards and displays DC/DC converter Embedded PC Mobile data gathering, telemetric <http://katalog.we-online.de/media/images/v2/WE-TPC_Gruppe_2.jpg> Details see: http://katalog.we-online.de/en/pbs/WE-TPC? Updated by Dan Xu 2014-07-11 2014 (C) Wurth Elektronik; WE-NUMBER: 744025002/2,2uH
R14 R15 R44-R46 = SparkFun-Passives:RESISTOR: Resistor Basic schematic elements and footprints for 0603, 1206, and PTH resistors.
U1 = TPS6274x:TPS6274X

## Module RF
Ports: GND(pwr) VCC(pwr) PAN1326_!SHUTD!(in) SI4705_!RST(in) CLK_IN(in) SI4705_I2C_SCL(in) SI4705_I2C_SDA(io) PAN1326_HCI_RX(in) PAN1326_HCI_TX(out) PAN1326_HCI_CTS(io) PAN1326_HCI_RTS(io) SI4705_FMI(in)
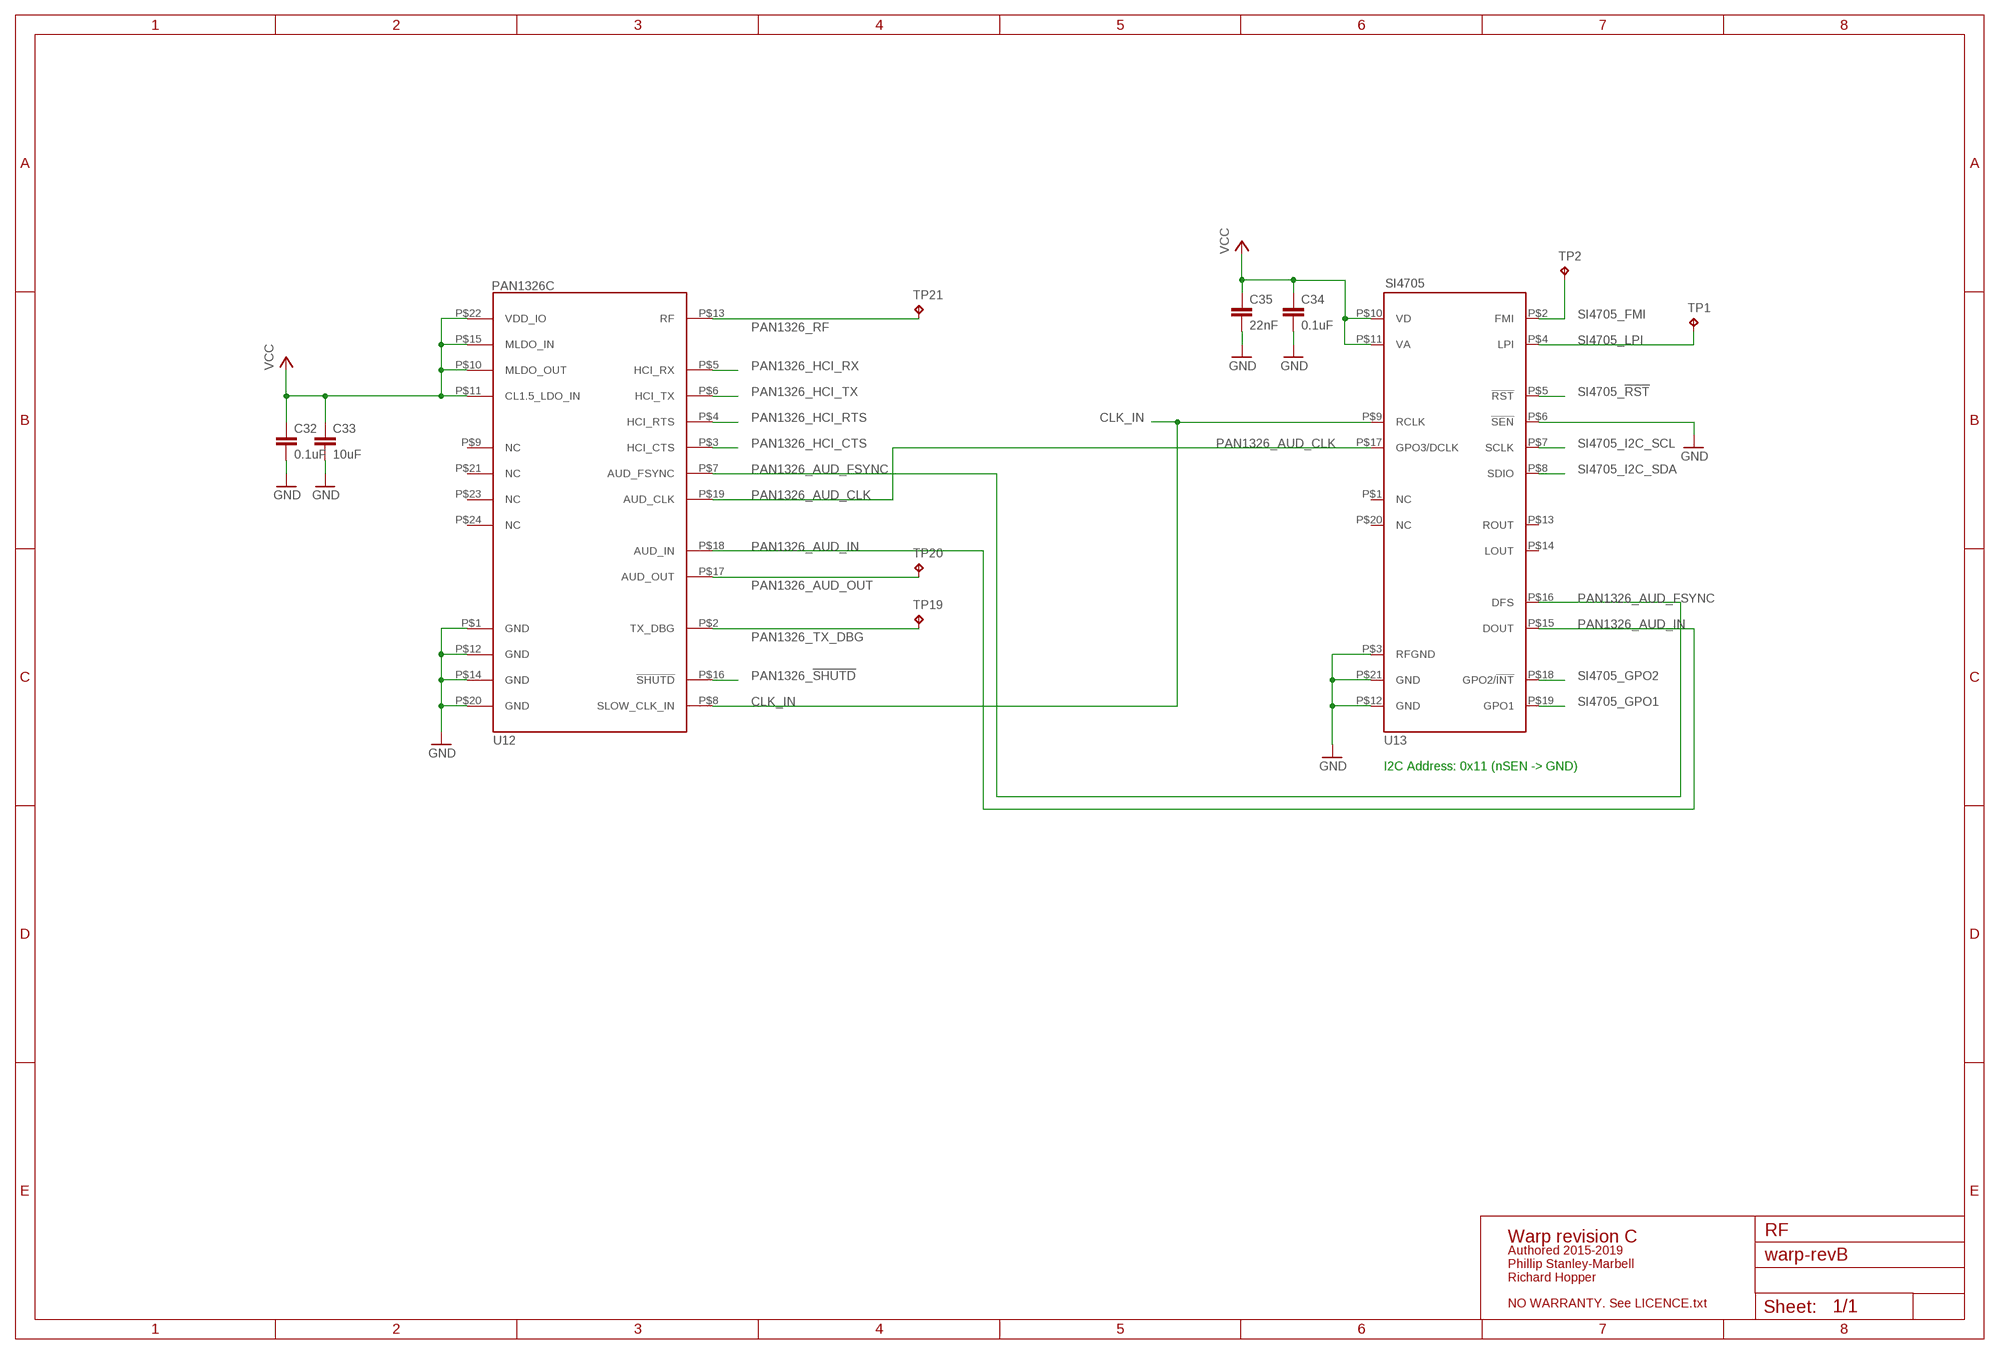
[diagram p5: schematic, module RF, sheet 1]

### Parts
C32  0.1uF  CAP0402-CAP  [0402-CAP]
C33  10uF  CAP0402-CAP  [0402-CAP]
C34  0.1uF  CAP0402-CAP  [0402-CAP]
C35  22nF  CAP0402-CAP  [0402-CAP]
TP1  TPTP06R  [TP06R]
TP2  TPTP06R  [TP06R]
TP19  TPTP06R  [TP06R]
TP20  TPTP06R  [TP06R]
TP21  TPTP06R  [TP06R]
U12  PAN1326C  PAN1326B  [PAN1326B]
U13  SI4705  [SI4705]

### Nets
CLK_IN: U12.P$8(SLOW_CLK_IN) U13.P$9(RCLK)
GND: U12.P$1(GND) U12.P$12(GND) U12.P$14(GND) U12.P$20(GND) U13.P$3(RFGND) U13.P$6(!SEN) U13.P$12(GND) U13.P$21(GND)
N$1: C32.2 ; supply symbol labelled GND
N$2: C33.2 ; supply symbol labelled GND
N$3: C35.2 ; supply symbol labelled GND
N$4: C34.2 ; supply symbol labelled GND
PAN1326_!SHUTD!: U12.P$16(!SHUTD)
PAN1326_AUD_CLK: U12.P$19(AUD_CLK) U13.P$17(GPO3/DCLK)
PAN1326_AUD_FSYNC: U12.P$7(AUD_FSYNC) U13.P$16(DFS)
PAN1326_AUD_IN: U12.P$18(AUD_IN) U13.P$15(DOUT)
PAN1326_AUD_OUT: TP20.TP U12.P$17(AUD_OUT)
PAN1326_HCI_CTS: U12.P$3(HCI_CTS)
PAN1326_HCI_RTS: U12.P$4(HCI_RTS)
PAN1326_HCI_RX: U12.P$5(HCI_RX)
PAN1326_HCI_TX: U12.P$6(HCI_TX)
PAN1326_RF: TP21.TP U12.P$13(RF)
PAN1326_TX_DBG: TP19.TP U12.P$2(TX_DBG)
SI4705_!RST: U13.P$5(!RST)
SI4705_FMI: TP2.TP U13.P$2(FMI)
SI4705_GPO1: U13.P$19(GPO1)
SI4705_GPO2: U13.P$18(GPO2/!INT)
SI4705_I2C_SCL: U13.P$7(SCLK)
SI4705_I2C_SDA: U13.P$8(SDIO)
SI4705_LPI: TP1.TP U13.P$4(LPI)
VCC: C32.1 C33.1 C34.1 C35.1 U12.P$10(MLDO_OUT) U12.P$11(CL1.5_LDO_IN) U12.P$15(MLDO_IN) U12.P$22(VDD_IO) U13.P$10(VD) U13.P$11(VA)
Unconnected: U12.P$9(NC) U12.P$21(NC) U12.P$23(NC) U12.P$24(NC) U13.P$1(NC) U13.P$13(ROUT) U13.P$14(LOUT) U13.P$20(NC)

### Notes on the sheet
- I2C Address: 0x11 (nSEN -> GND)
- RF
- Warp revision C
- Authored 2015-2019
  Phillip Stanley-Marbell
  Richard Hopper
- NO WARRANTY. See LICENCE.txt

### Library data of the parts
C32-C35 = SparkFun-Passives:CAP: Capacitor Standard 0603 ceramic capacitor, and 0.1" leaded capacitor.
TP1 TP2 TP19-TP21 = testpad:TP: Test pad
U12 = PAN1326B:PAN1326B: PAN1326B HCI Class 1.5 TI-based Bluetooth module.
U13 = SI4705:SI4705: Si4705 BROADCAST FM RADIO RECEIVER FOR CONSUMER ELECTRONICS.

## Module SENSORS-1
Ports: GND(pwr) I2C_SCL(in) I2C_SDA(io) ADXL362_SPI_CS(in) SPI_SCK(in) SPI_MISO(out) SPI_MOSI(in) VCC(pwr) ISL23415_SPI_CS(in) DCP_RW1(io) DCP_RW2(io)
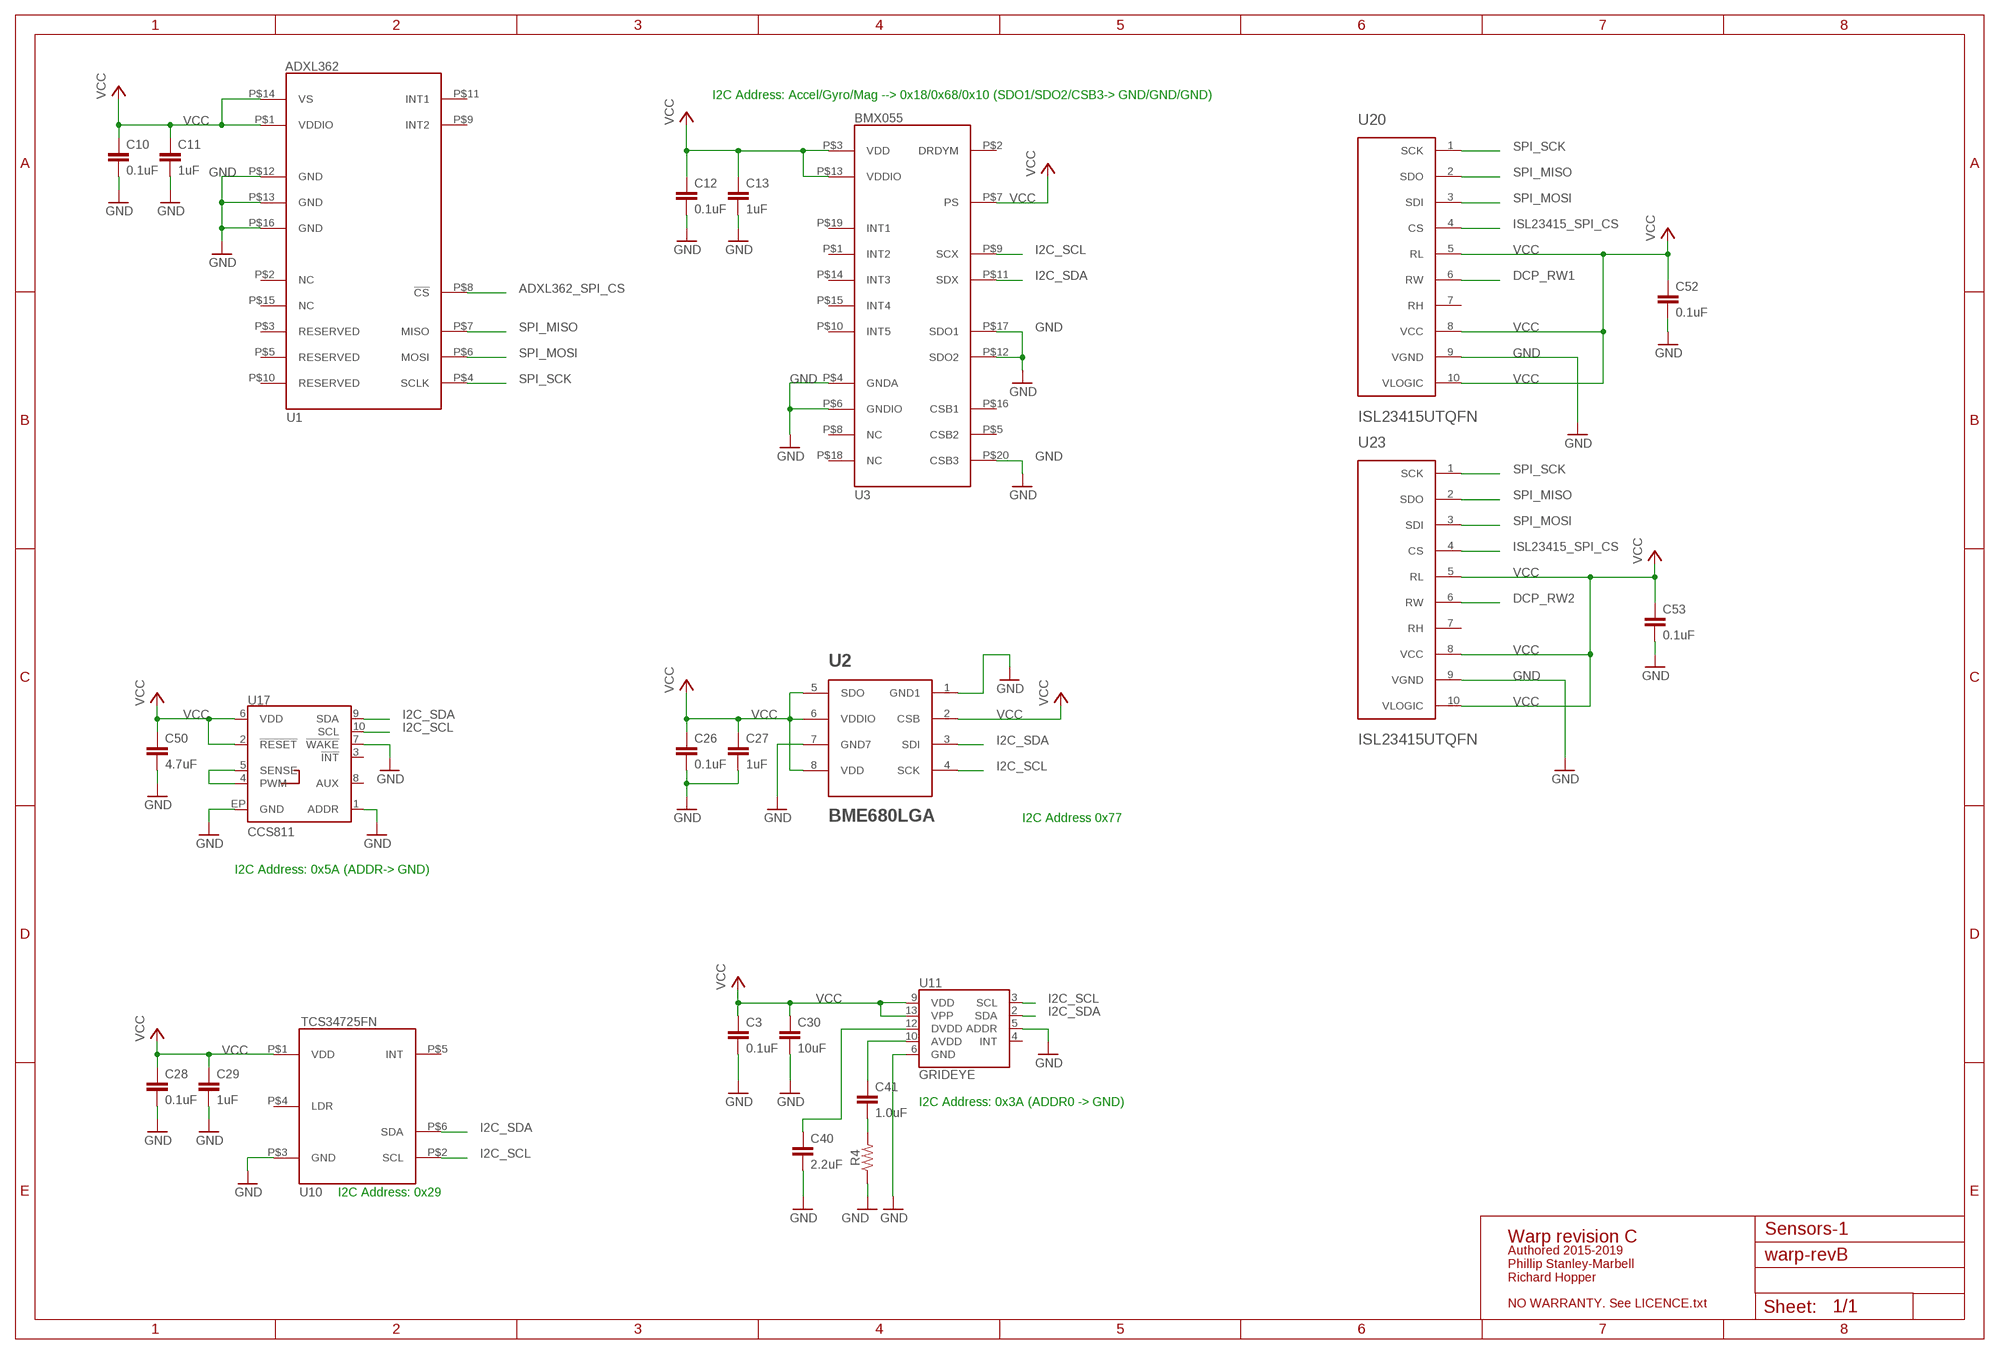
[diagram p6: schematic, module SENSORS-1, sheet 1]

### Parts
C3  0.1uF  CAP0402-CAP  [0402-CAP]
C10  0.1uF  CAP0402-CAP  [0402-CAP]
C11  1uF  CAP0402-CAP  [0402-CAP]
C12  0.1uF  CAP0402-CAP  [0402-CAP]
C13  1uF  CAP0402-CAP  [0402-CAP]
C26  0.1uF  CAP0402-CAP  [0402-CAP]
C27  1uF  CAP0402-CAP  [0402-CAP]
C28  0.1uF  CAP0402-CAP  [0402-CAP]
C29  1uF  CAP0402-CAP  [0402-CAP]
C30  10uF  CAP0402-CAP  [0402-CAP]
C40  2.2uF  CAP0402-CAP  [0402-CAP]
C41  1.0uF  CAP0402-CAP  [0402-CAP]
C50  4.7uF  CAP0402-CAP  [0402-CAP]
C52  0.1uF  CAP0402-CAP  [0402-CAP]
C53  0.1uF  CAP0402-CAP  [0402-CAP]
R4  RESISTOR0402  [0402]
U1  ADXL362  [ADXL362]
U2  BME680LGA  [BME680]
U3  BMX055  [BMX055]
U10  TCS34725FN  TCS3772  [TCS3772]
U11  GRIDEYE  [GRIDEYE-AMG88]
U17  CCS811  CCS811PRODUCTION  [LGA10]
U20  ISL23415UTQFN  [ISL23415]
U23  ISL23415UTQFN  [ISL23415]

### Nets
ADXL362_SPI_CS: U1.P$8(!CS)
DCP_RW1: U20.6(RW)
DCP_RW2: U23.6(RW)
GND: C26.2 C27.2 C41.1 C41.2 R4.2 U1.P$12(GND) U1.P$13(GND) U1.P$16(GND) U2.1(GND1) U2.7(GND7) U3.P$4(GNDA) U3.P$6(GNDIO) U3.P$12(SDO2) U3.P$17(SDO1) U3.P$20(CSB3) U10.P$3(GND) U11.5(ADDR) U11.6(GND) U11.10(AVDD) U17.1(ADDR) U17.7(!WAKE!) U17.EP(GND) U20.9(VGND) U23.9(VGND)
I2C_SCL: U2.4(SCK) U3.P$9(SCX) U10.P$2(SCL) U11.3(SCL) U17.10(SCL)
I2C_SDA: U2.3(SDI) U3.P$11(SDX) U10.P$6(SDA) U11.2(SDA) U17.9(SDA)
ISL23415_SPI_CS: U20.4(CS) U23.4(CS)
N$7: U17.4(PWM) U17.5(SENSE)
N$8: C10.2 ; supply symbol labelled GND
N$9: C11.2 ; supply symbol labelled GND
N$10: C12.2 ; supply symbol labelled GND
N$11: C13.2 ; supply symbol labelled GND
N$18: C28.2 ; supply symbol labelled GND
N$19: C29.2 ; supply symbol labelled GND
N$20: C3.2 ; supply symbol labelled GND
N$21: C30.2 ; supply symbol labelled GND
N$22: C40.2 ; supply symbol labelled GND
N$23: R4.1 ; supply symbol labelled GND
N$24: C52.2 ; supply symbol labelled GND
N$25: C50.2 ; supply symbol labelled GND
N$27: C53.2 ; supply symbol labelled GND
SPI_MISO: U1.P$7(MISO) U20.2(SDO) U23.2(SDO)
SPI_MOSI: U1.P$6(MOSI) U20.3(SDI) U23.3(SDI)
SPI_SCK: U1.P$4(SCLK) U20.1(SCK) U23.1(SCK)
VCC: C3.1 C10.1 C11.1 C12.1 C13.1 C26.1 C27.1 C28.1 C29.1 C30.1 C40.1 C50.1 C52.1 C53.1 U1.P$1(VDDIO) U1.P$14(VS) U2.2(CSB) U2.5(SDO) U2.6(VDDIO) U2.8(VDD) U3.P$3(VDD) U3.P$7(PS) U3.P$13(VDDIO) U10.P$1(VDD) U11.9(VDD) U11.12(DVDD) U11.13(VPP) U17.2(!RESET!) U17.6(VDD) U20.5(RL) U20.8(VCC) U20.10(VLOGIC) U23.5(RL) U23.8(VCC) U23.10(VLOGIC)
Unconnected: U1.P$2(NC) U1.P$3(RESERVED) U1.P$5(RESERVED) U1.P$9(INT2) U1.P$10(RESERVED) U1.P$11(INT1) U1.P$15(NC) U3.P$1(INT2) U3.P$2(DRDYM) U3.P$5(CSB2) U3.P$8(NC) U3.P$10(INT5) U3.P$14(INT3) U3.P$15(INT4) U3.P$16(CSB1) U3.P$18(NC) U3.P$19(INT1) U10.P$4(LDR) U10.P$5(INT) U11.4(INT) U17.3(!INT!) U17.8(AUX) U20.7(RH) U23.7(RH)

### Notes on the sheet
- I2C Address: Accel/Gyro/Mag --> 0x18/0x68/0x10 (SDO1/SDO2/CSB3-> GND/GND/GND)
- I2C Address 0x77
- I2C Address: 0x5A (ADDR-> GND)
- I2C Address: 0x3A (ADDR0 -> GND)
- I2C Address: 0x29
- Sensors-1
- Warp revision C
- Authored 2015-2019
  Phillip Stanley-Marbell
  Richard Hopper
- NO WARRANTY. See LICENCE.txt

### Library data of the parts
C3 C10-C13 C26-C30 C40 C41 C50 C52 C53 = SparkFun-Passives:CAP: Capacitor Standard 0603 ceramic capacitor, and 0.1" leaded capacitor.
R4 = SparkFun-Resistors:RESISTOR: Generic Resistor Package
U1 = ADXL362:ADXL362: ADXL362, Micropower, 3-Axis, ±2 g/±4 g/±8 g Digital Output MEMS Accelerometer.
U2 = BME680:BME680
U3 = BMX055:BMX055: BMX055 Small, versatile 9-axis sensor module (accelerometer, gyro, and magnetometer).
U10 = TCS3772:TCS3772: TCS3772 COLOR LIGHT-TO-DIGITAL CONVERTER with PROXIMITY SENSING.
U11 = Grideye:GRIDEYE
U17 = SparkFun-Sensors:CCS811: AMS CCS811 – I2C Digital Gas Sensor Ultra-Low Power Digital Gas Sensor for Monitoring Indoor Air Quality AMS Product Page <http://ams.com/eng/Products/Environmental-Sensors/Gas-Sensors/CCS811> SparkFun Products:; PROD_ID: IC-13607
U20 U23 = ISL23415:ISL23415

## Module FT4222
Ports: I2C_SCL(in) SPI_MISO(out) SPI_SCK(in) SPI_MOSI(in) SS0O(in) VCC(pwr) VCCIO(pwr) DM(io) DP(io) I2C_SDA(io) GND(pwr)
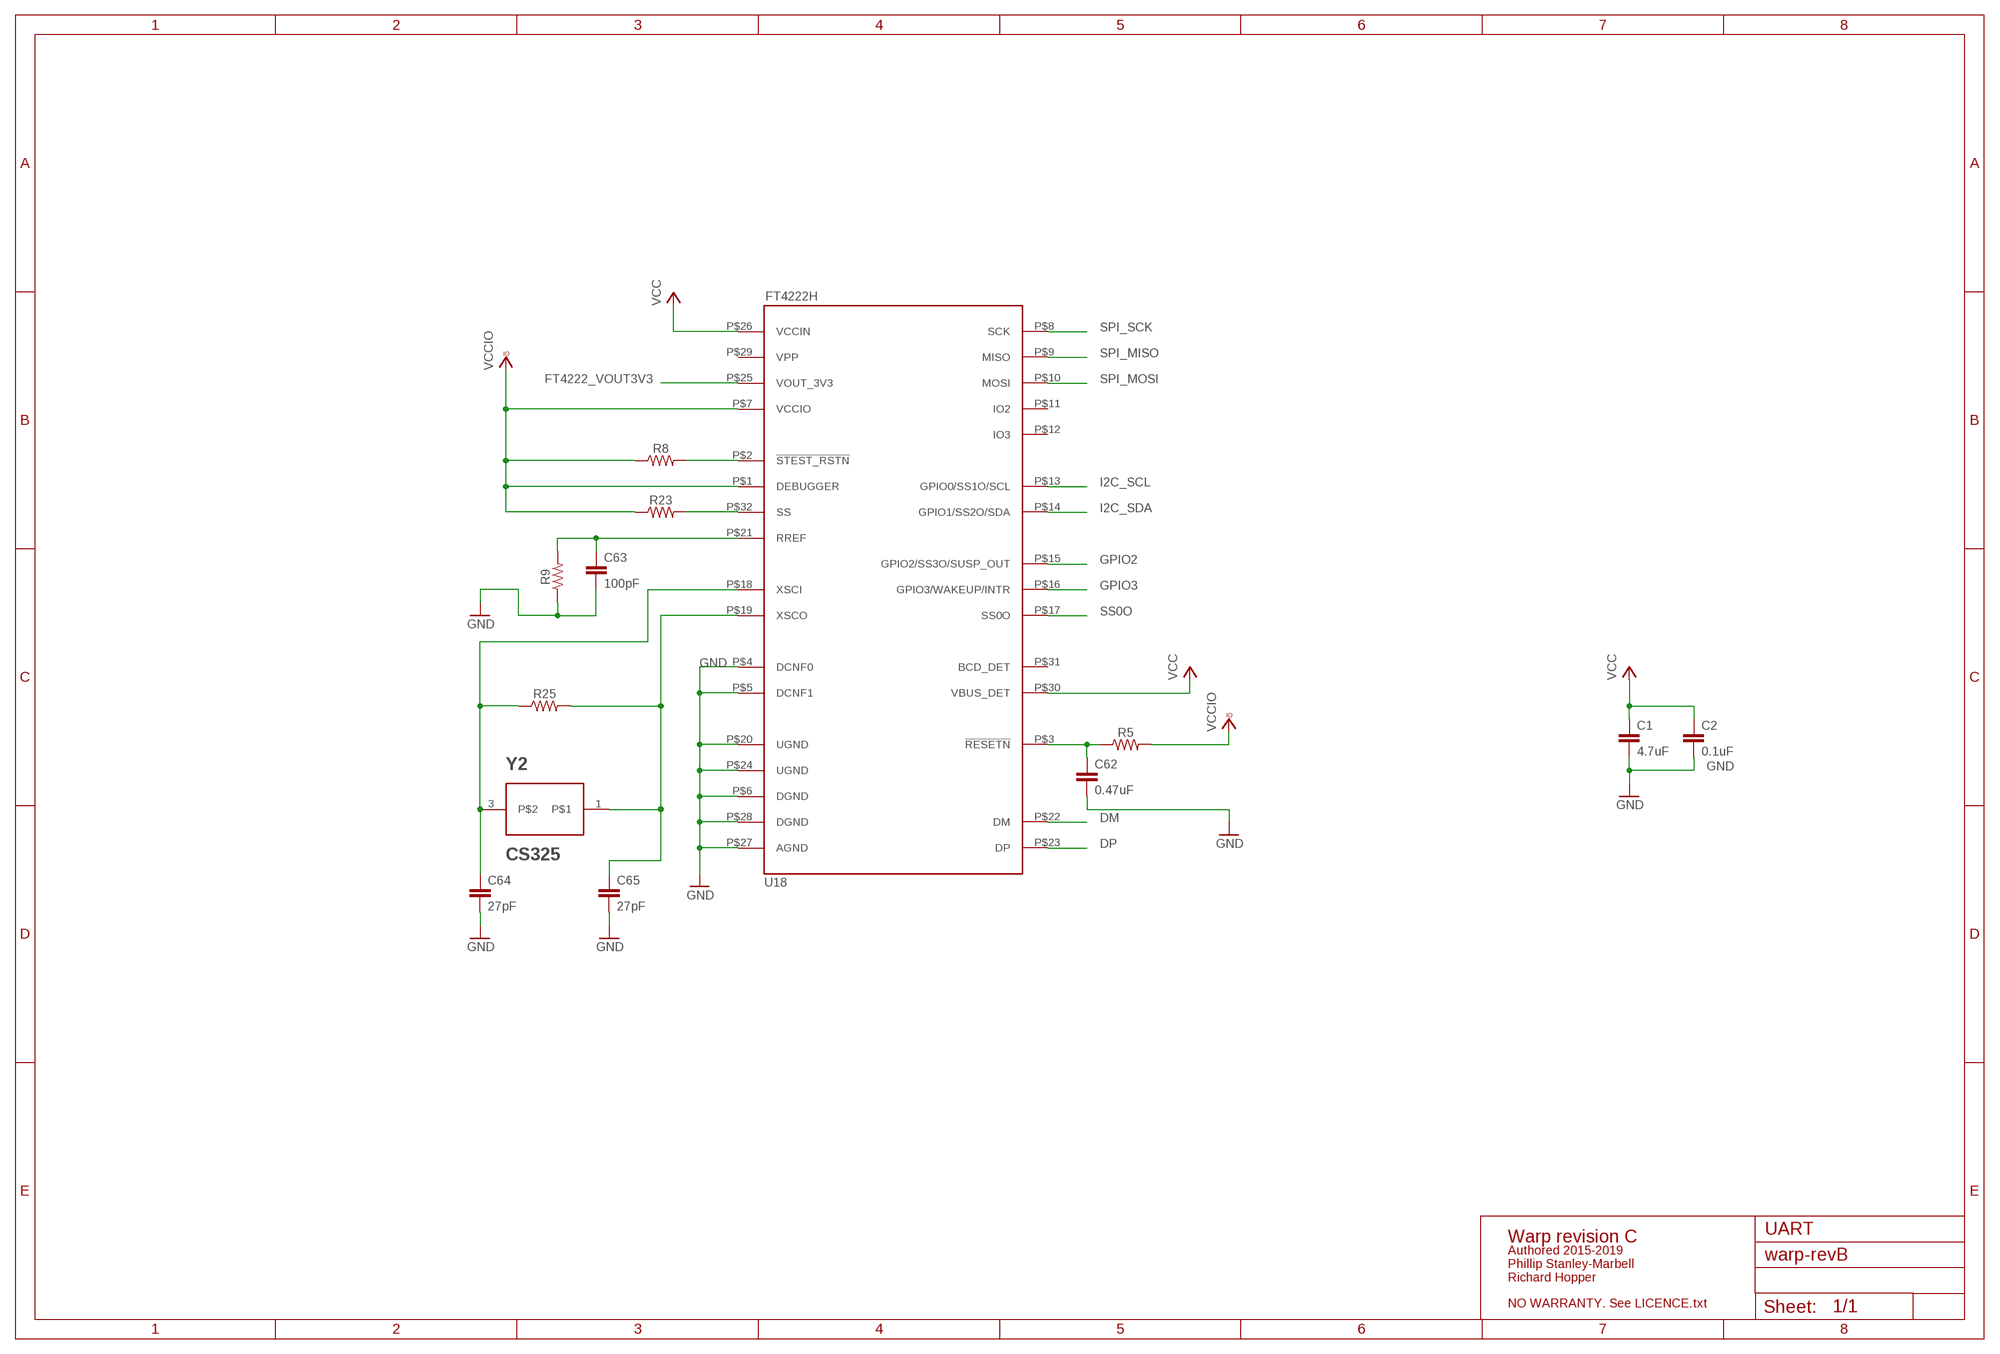
[diagram p7: schematic, module FT4222, sheet 1]

### Parts
C1  4.7uF  CAP0805  [0805]
C2  0.1uF  CAP0603-CAP  [0603-CAP]
C62  0.47uF  CAP0402-CAP  [0402-CAP]
C63  100pF  CAP0402-CAP  [0402-CAP]
C64  27pF  CAP0402-CAP  [0402-CAP]
C65  27pF  CAP0402-CAP  [0402-CAP]
R5  RESISTOR0402  [0402]
R8  RESISTOR0402  [0402]
R9  RESISTOR0402  [0402]
R23  RESISTOR0402  [0402]
R25  RESISTOR0402  [0402]
U18  FT4222H  [FT4222H]
Y2  CS325  [CS325]

### Nets
DM: U18.P$22(DM)
DP: U18.P$23(DP)
FT4222_VOUT3V3: U18.P$25(VOUT_3V3)
GND: C1.2 C2.2 C62.2 C63.2 C64.2 C65.2 R9.1 U18.P$4(DCNF0) U18.P$5(DCNF1) U18.P$6(DGND) U18.P$20(UGND) U18.P$24(UGND) U18.P$27(AGND) U18.P$28(DGND)
GPIO2: U18.P$15(GPIO2/SS3O/SUSP_OUT)
GPIO3: U18.P$16(GPIO3/WAKEUP/INTR)
I2C_SCL: U18.P$13(GPIO0/SS1O/SCL)
I2C_SDA: U18.P$14(GPIO1/SS2O/SDA)
N$2: R23.2 U18.P$32(SS)
N$3: R8.2 U18.P$2(!STEST_RSTN)
N$4: C62.1 R5.1 U18.P$3(!RESETN)
N$5: C63.1 R9.2 U18.P$21(RREF)
N$6: C64.1 R25.1 U18.P$18(XSCI) Y2.3
N$15: C65.1 R25.2 U18.P$19(XSCO) Y2.1
SPI_MISO: U18.P$9(MISO)
SPI_MOSI: U18.P$10(MOSI)
SPI_SCK: U18.P$8(SCK)
SS0O: U18.P$17(SS0O)
VCC: C1.1 C2.1 U18.P$26(VCCIN) U18.P$30(VBUS_DET)
VCCIO: R5.2 R8.1 R23.1 U18.P$1(DEBUGGER) U18.P$7(VCCIO)
Unconnected: U18.P$11(IO2) U18.P$12(IO3) U18.P$31(BCD_DET)

### Notes on the sheet
- UART
- Warp revision C
- Authored 2015-2019
  Phillip Stanley-Marbell
  Richard Hopper
- NO WARRANTY. See LICENCE.txt

### Power pins joined to a net without a drawn wire
VPP: U18.P$29(VPP)

### Library data of the parts
C1 C2 C62-C65 = SparkFun-Passives:CAP: Capacitor Standard 0603 ceramic capacitor, and 0.1" leaded capacitor.
R5 R8 R9 R23 R25 = SparkFun-Resistors:RESISTOR: Generic Resistor Package
U18 = FT4222H:FT4222H: FT4222H USB2.0 TO QUADSPI/I2C BRIDGE IC.
Y2 = CS325:CS325

## Module USB
Ports: +5V(pwr) DM(io) DP(io) GND(pwr)
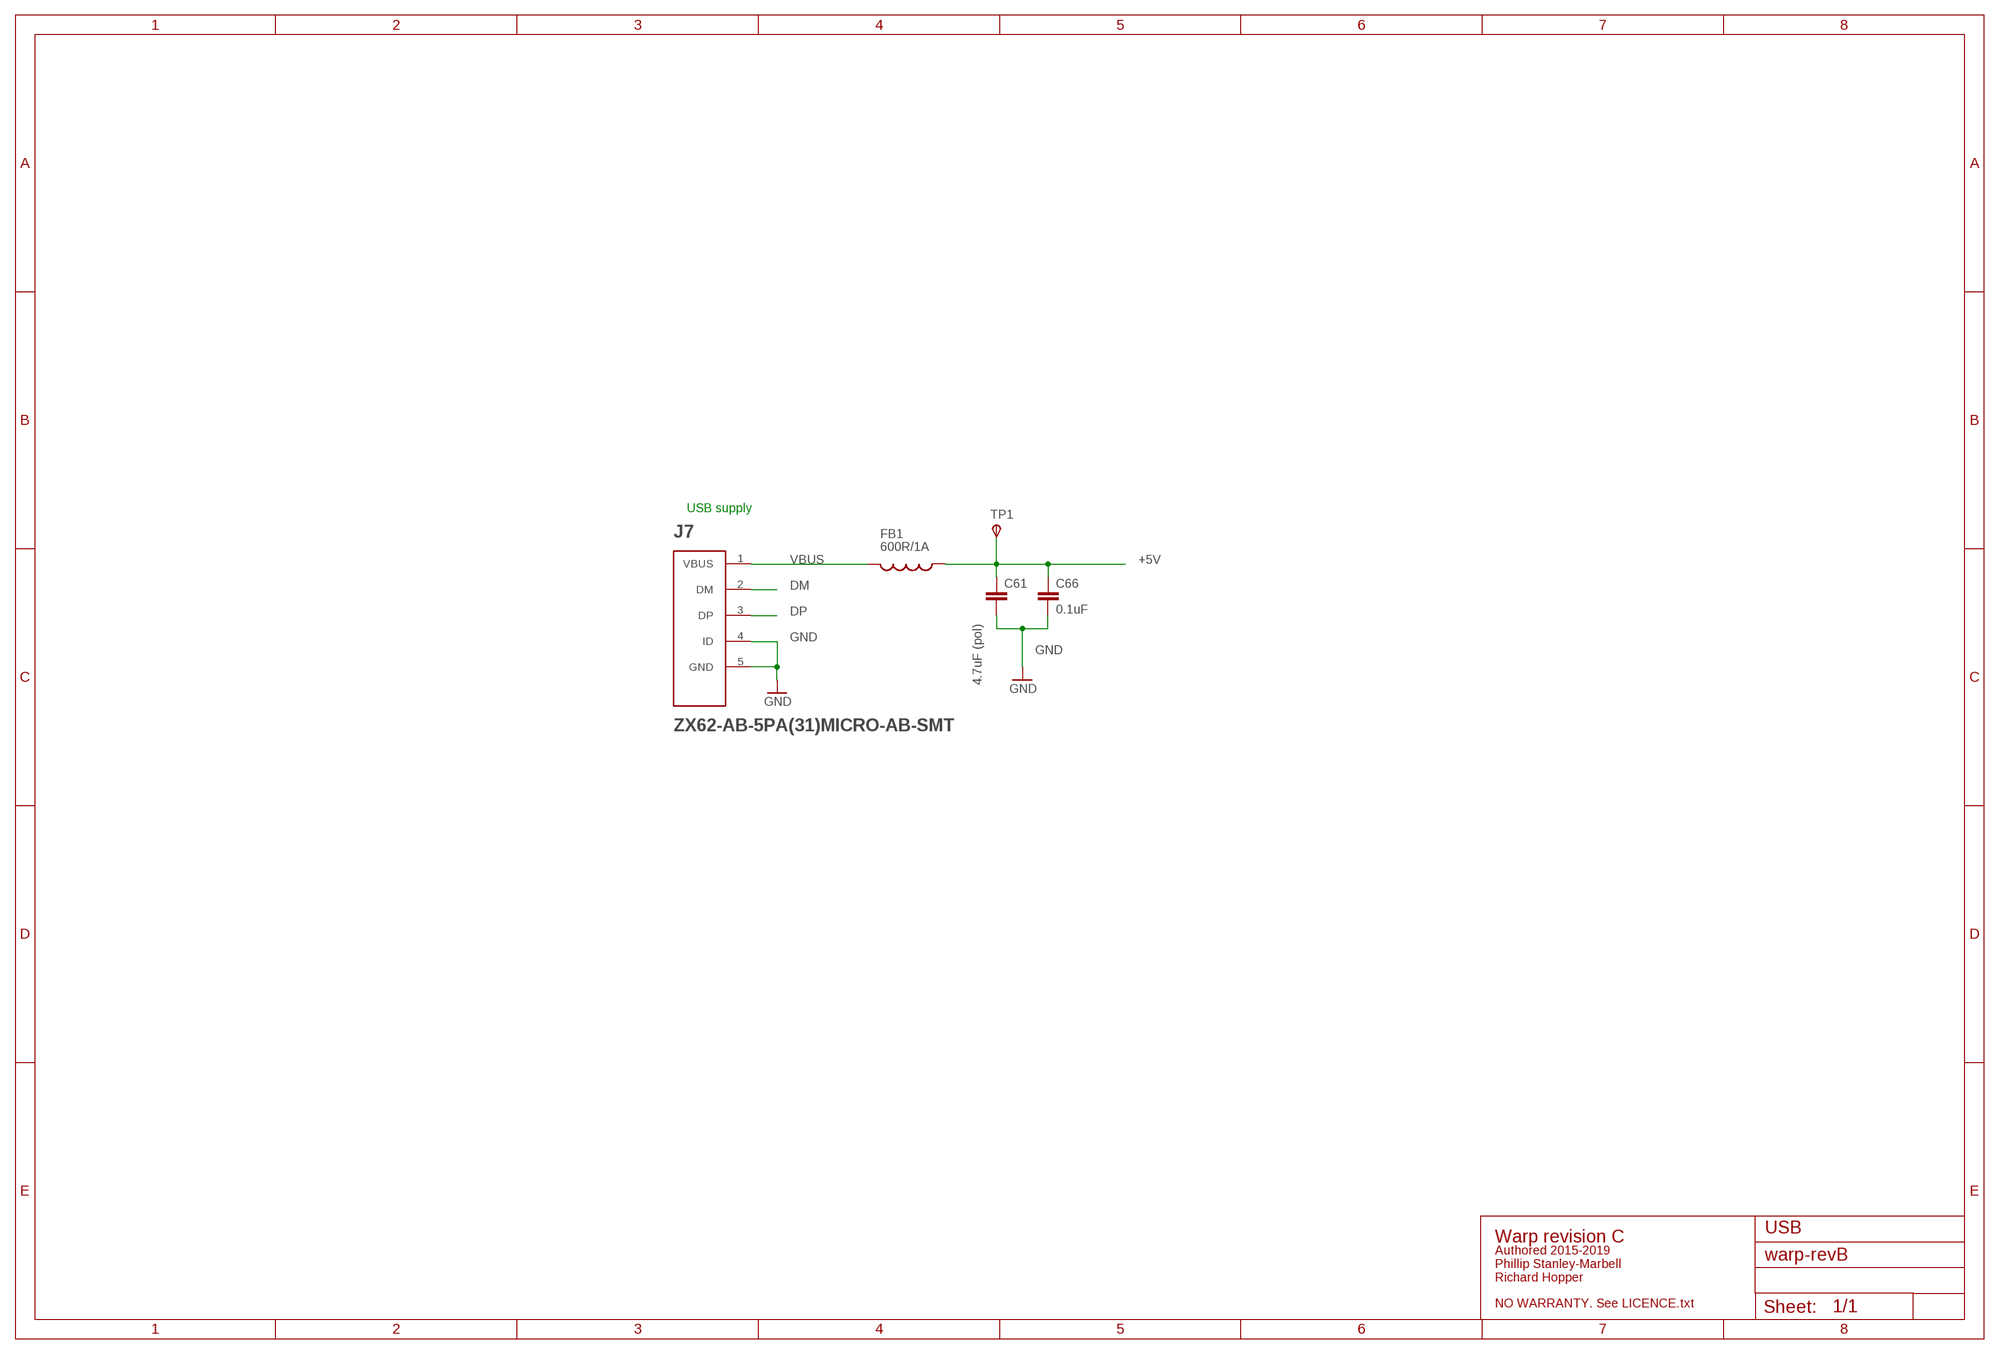
[diagram p8: schematic, module USB, sheet 1]

### Parts
C61  4.7uF (pol)  CAP0402-CAP  [0402-CAP]
C66  0.1uF  CAP0402-CAP  [0402-CAP]
FB1  600R/1A  INDUCTOR0603  [0603]
J7  ZX62-AB-5PA(31)MICRO-AB-SMT  [ZX62-AB-5PA(31)]
TP1  TPSTP06R  [TP06R]

### Nets
+5V: C61.1 C66.1 FB1.1 TP1.TP(PP)
DM: J7.2(DM)
DP: J7.3(DP)
GND: C61.2 C66.2 J7.4(ID) J7.5(GND)
VBUS: FB1.2 J7.1(VBUS)

### Notes on the sheet
- USB supply
- USB
- Warp revision C
- Authored 2015-2019
  Phillip Stanley-Marbell
  Richard Hopper
- NO WARRANTY. See LICENCE.txt

### Library data of the parts
C61 C66 = SparkFun-Passives:CAP: Capacitor Standard 0603 ceramic capacitor, and 0.1" leaded capacitor.
FB1 = SparkFun-Passives:INDUCTOR: Inductors Basic Inductor/Choke - 0603 and 1206. Footprints are not proven and vary greatly between part numbers.
J7 = ZX62-AB-5PA(31):ZX62-AB-5PA(31)
TP1 = testpad:TPS: TEST PIN

## Module FPGA
Ports: GND(pwr) VCC(pwr) SPI_SCK(in) SPI_MISO(out) SPI_MOSI(in) SPI_CS(in) IOB_2A(io) IOB_3B_G6(io) IOB_9B(io) IOB_10A(io) IOB_11B_G5(io) IOB_12A_G4_CDONE(io) IOB_13B(io) IOB_24A(io) IOB_25B_G3(io) IOT_46B_G0(io) IOT_47A(io) RGB0(io) RGB1(io) RGB2(io) I2C1_SCL(in) I2C1_SDA(io) I2C2_SCL(out) I2C2_SDA(io) EN(in) VREG(pwr)
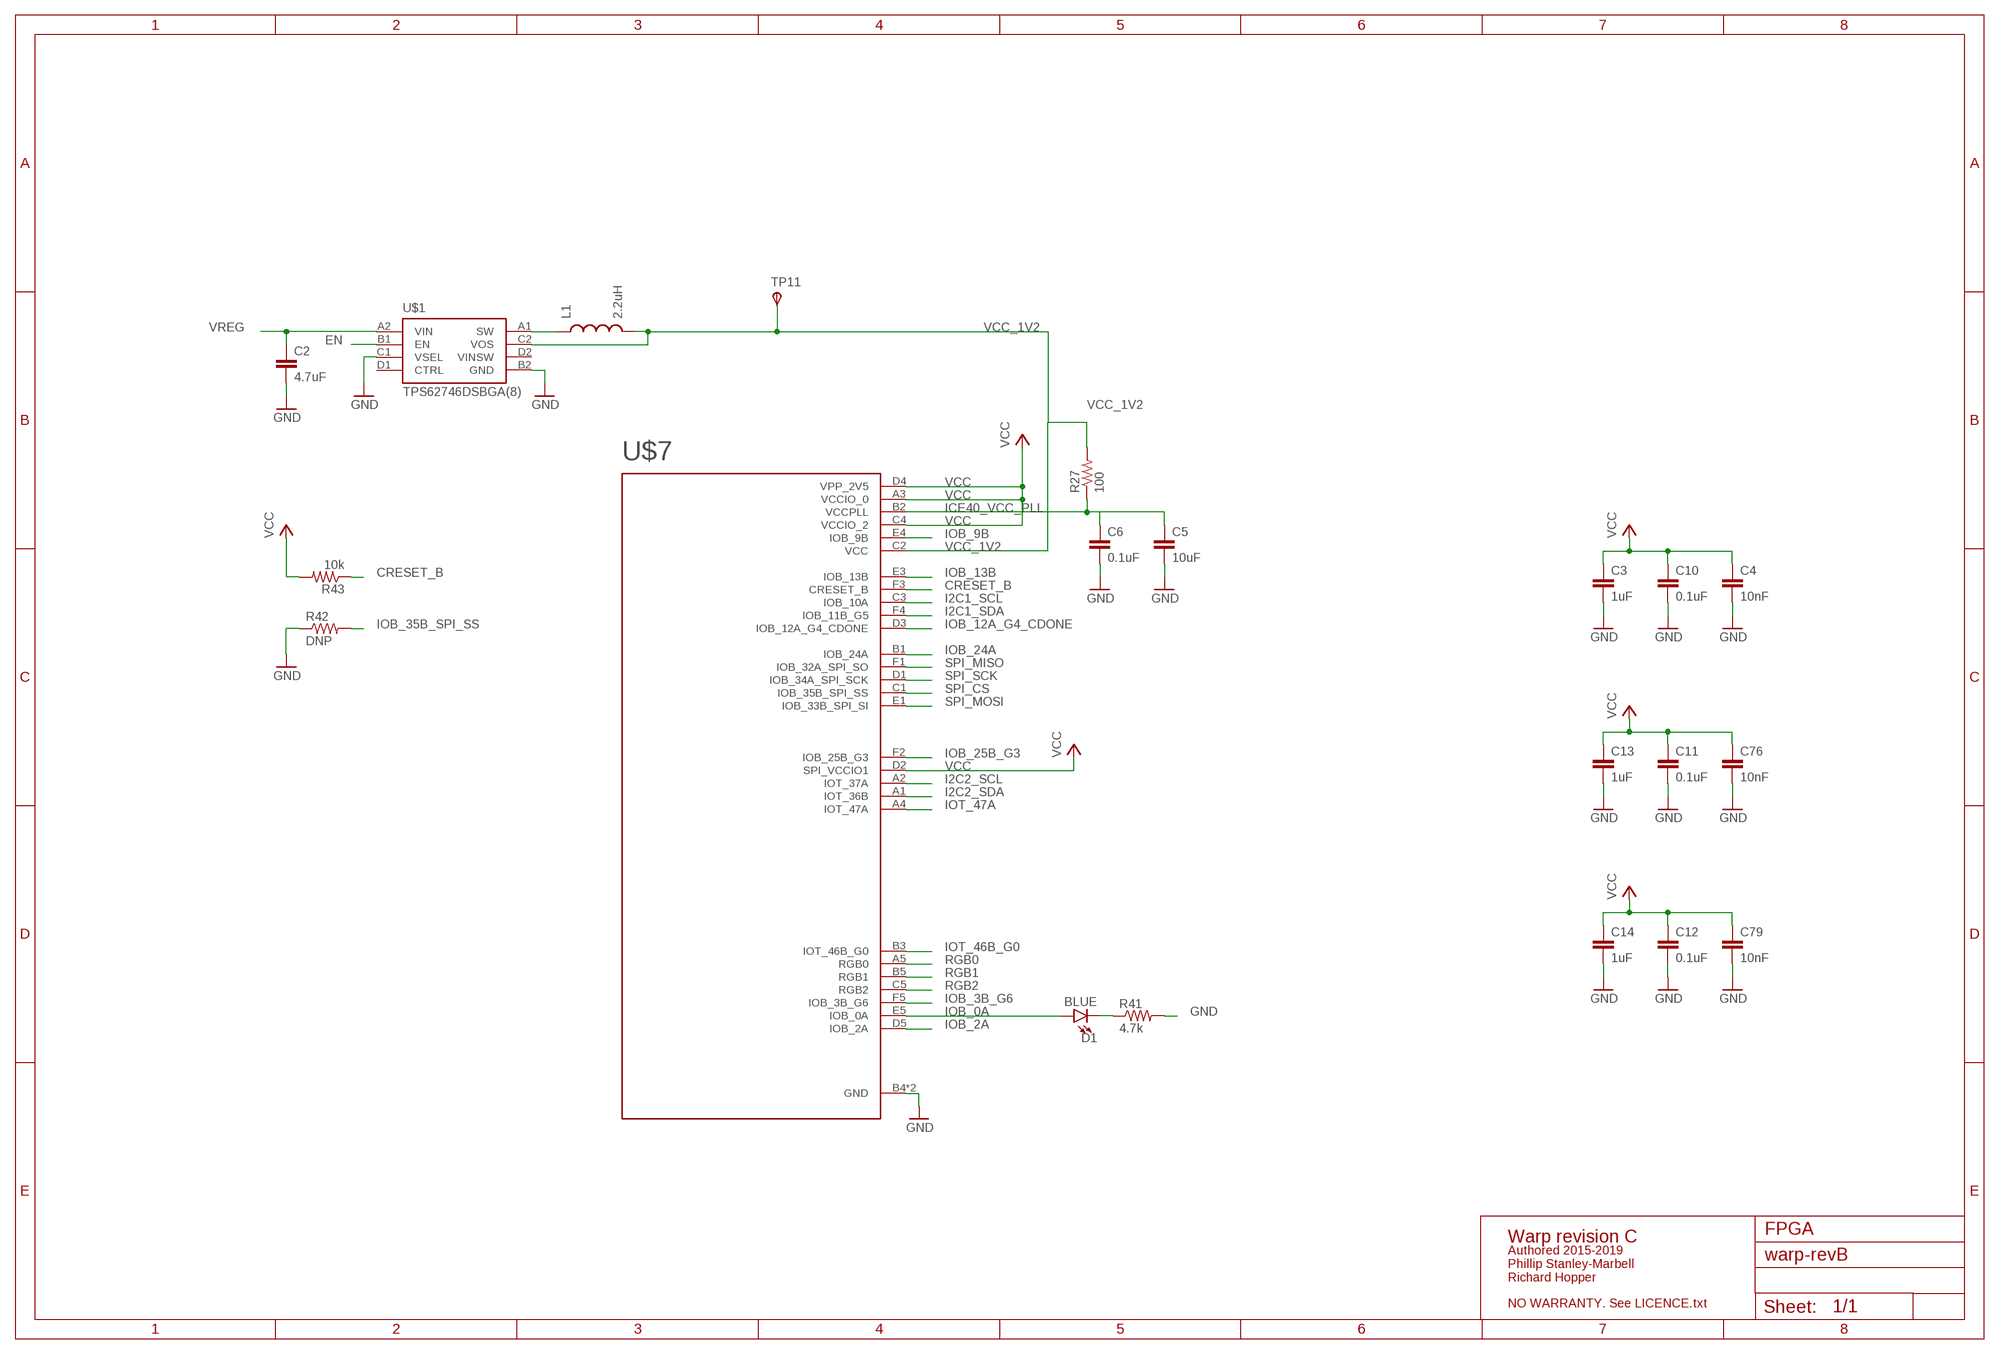
[diagram p9: schematic, module FPGA, sheet 1]

### Parts
C2  4.7uF  CAP0805  [0805]
C3  1uF  CAP0805  [0805]
C4  10nF  CAP0402-CAP  [0402-CAP]
C5  10uF  CAP0805  [0805]
C6  0.1uF  CAP0603-CAP  [0603-CAP]
C10  0.1uF  CAP0603-CAP  [0603-CAP]
C11  0.1uF  CAP0603-CAP  [0603-CAP]
C12  0.1uF  CAP0603-CAP  [0603-CAP]
C13  1uF  CAP0805  [0805]
C14  1uF  CAP0805  [0805]
C76  10nF  CAP0402-CAP  [0402-CAP]
C79  10nF  CAP0402-CAP  [0402-CAP]
D1  BLUE  LED-BLUE0603  [LED-0603]
L1  2.2uH  WURTH-744025002  [WURTH-744025002]
R27  100  RESISTOR0402-RES  [0402-RES]
R41  4.7k  RESISTOR0402-RES  [0402-RES]
R42  DNP  RESISTOR0402-RES  [0402-RES]
R43  10k  RESISTOR0402-RES  [0402-RES]
TP11  TPSTP06R  [TP06R]
U$1  TPS62746DSBGA(8)  [DSBGA]
U$7  ICE40UP5K-UWG30  [LATTICE-WLCSP-30]

### Nets
CRESET_B: R43.1 U$7.F3(CRESET_B)
EN: U$1.B1(EN)
GND: C2.2 C3.2 C4.2 C5.2 C6.2 C10.2 C11.2 C12.2 C13.2 C14.2 C76.2 C79.2 R41.2 R42.1 U$1.B2(GND) U$1.C1(VSEL) U$7.B4(GND) U$7.E2(GND)
I2C1_SCL: U$7.C3(IOB_10A)
I2C1_SDA: U$7.F4(IOB_11B_G5)
I2C2_SCL: U$7.A2(IOT_37A)
I2C2_SDA: U$7.A1(IOT_36B)
ICE40_VCC_PLL: C5.1 C6.1 R27.1 U$7.B2(VCCPLL)
IOB_0A: D1.A U$7.E5(IOB_0A)
IOB_2A: U$7.D5(IOB_2A)
IOB_3B_G6: U$7.F5(IOB_3B_G6)
IOB_9B: U$7.E4(IOB_9B)
IOB_12A_G4_CDONE: U$7.D3(IOB_12A_G4_CDONE)
IOB_13B: U$7.E3(IOB_13B)
IOB_24A: U$7.B1(IOB_24A)
IOB_25B_G3: U$7.F2(IOB_25B_G3)
IOB_35B_SPI_SS: R42.2
IOT_46B_G0: U$7.B3(IOT_46B_G0)
IOT_47A: U$7.A4(IOT_47A)
N$1: D1.C R41.1
N$2: L1.1 U$1.A1(SW)
RGB0: U$7.A5(RGB0)
RGB1: U$7.B5(RGB1)
RGB2: U$7.C5(RGB2)
SPI_CS: U$7.C1(IOB_35B_SPI_SS)
SPI_MISO: U$7.F1(IOB_32A_SPI_SO)
SPI_MOSI: U$7.E1(IOB_33B_SPI_SI)
SPI_SCK: U$7.D1(IOB_34A_SPI_SCK)
VCC: C3.1 C4.1 C10.1 C11.1 C12.1 C13.1 C14.1 C76.1 C79.1 R43.2 U$7.A3(VCCIO_0) U$7.C4(VCCIO_2) U$7.D2(SPI_VCCIO1) U$7.D4(VPP_2V5)
VCC_1V2: L1.2 R27.2 TP11.TP(PP) U$1.C2(VOS) U$7.C2(VCC)
VREG: C2.1 U$1.A2(VIN)
Unconnected: U$1.D1(CTRL) U$1.D2(VINSW)

### Notes on the sheet
- FPGA
- Warp revision C
- Authored 2015-2019
  Phillip Stanley-Marbell
  Richard Hopper
- NO WARRANTY. See LICENCE.txt

### Library data of the parts
C2-C6 C10-C14 C76 C79 = SparkFun-Passives:CAP: Capacitor Standard 0603 ceramic capacitor, and 0.1" leaded capacitor.
D1 = SparkFun-LED:LED-BLUE: Blue SMD LED Used in manufacturing of various products at SparkFun Packages: 0603 - SMD 0603 package [Product Link] <http://www.digikey.com/product-detail/en/SMLE12BC7TT86/511-1589-2-ND/1641808> 1206 - SMD1206 package [Product Link] <http://www.digikey.com/product-detail/en/lite-on-inc/LTST-C150TBKT/160-1643-1-ND/573584> SparkFun Products: ESP8266 Thing-Dev Board <https://www.sparkfun.com/products/13711> RedBoard <https://www.sparkfun.com/products/12757>; PROD_ID: DIO-08575
L1 = WURTH-744025002:WURTH-744025002
R27 R41-R43 = SparkFun-Passives:RESISTOR: Resistor Basic schematic elements and footprints for 0603, 1206, and PTH resistors.
TP11 = testpad:TPS: TEST PIN
U$1 = TPS62746:TPS62746: BGA
U$7 = ICE40UP5K:ICE40UP5K-UWG30

## Module SENSORS-2
Ports: GND(pwr) VCC(pwr) I2C_SCL(in) I2C_SDA(io)
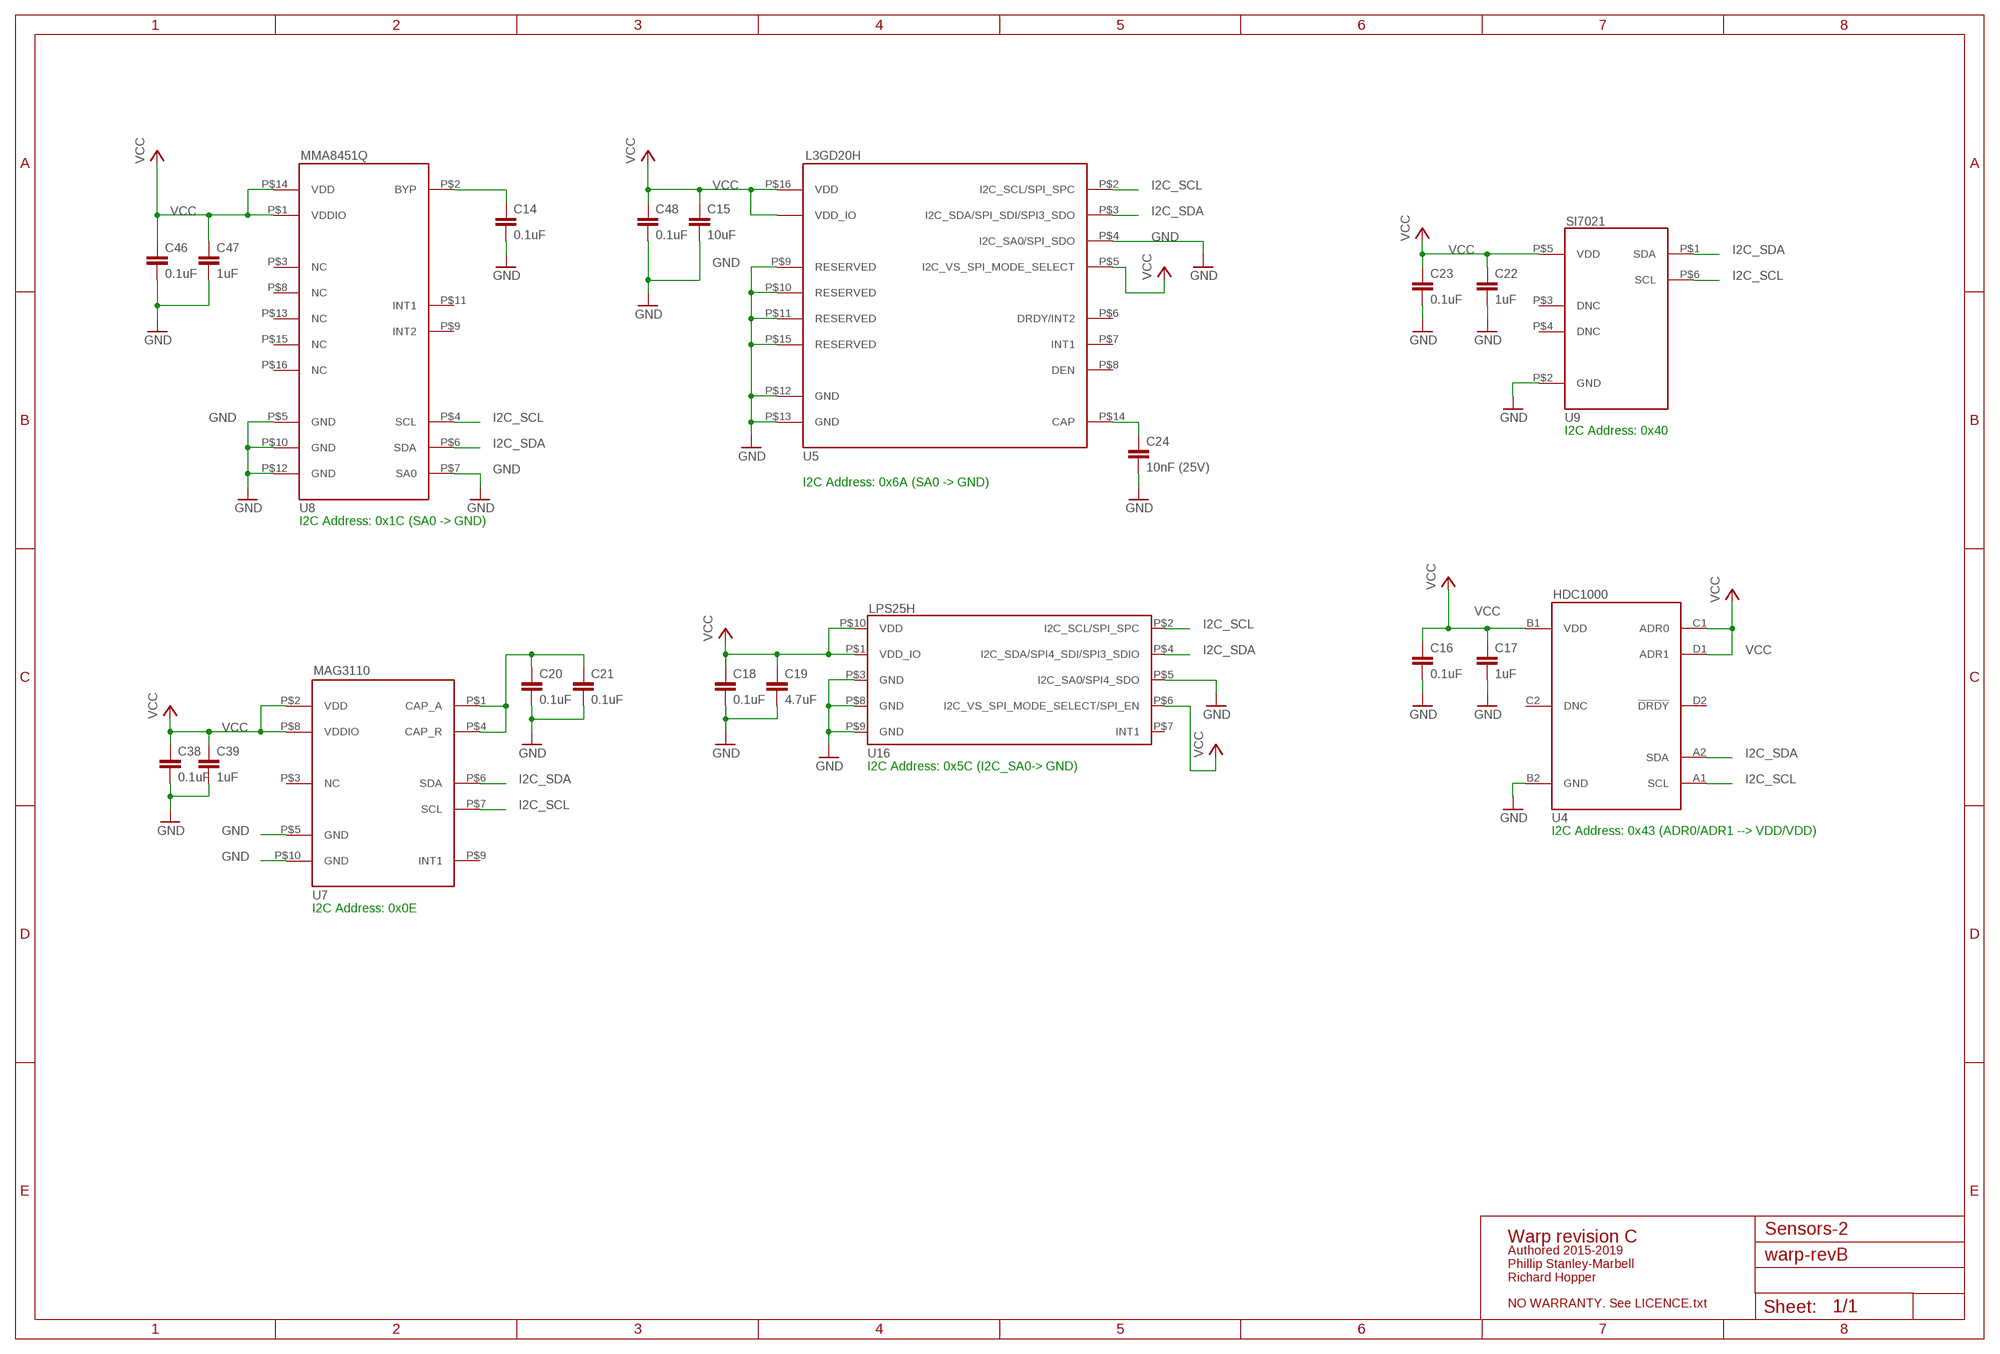
[diagram p10: schematic, module SENSORS-2, sheet 1]

### Parts
C14  0.1uF  CAP0402-CAP  [0402-CAP]
C15  10uF  CAP0402-CAP  [0402-CAP]
C16  0.1uF  CAP0402-CAP  [0402-CAP]
C17  1uF  CAP0402-CAP  [0402-CAP]
C18  0.1uF  CAP0402-CAP  [0402-CAP]
C19  4.7uF  CAP0402-CAP  [0402-CAP]
C20  0.1uF  CAP0402-CAP  [0402-CAP]
C21  0.1uF  CAP0402-CAP  [0402-CAP]
C22  1uF  CAP0402-CAP  [0402-CAP]
C23  0.1uF  CAP0402-CAP  [0402-CAP]
C24  10nF (25V)  CAP0402-CAP  [0402-CAP]
C38  0.1uF  CAP0402-CAP  [0402-CAP]
C39  1uF  CAP0402-CAP  [0402-CAP]
C46  0.1uF  CAP0402-CAP  [0402-CAP]
C47  1uF  CAP0402-CAP  [0402-CAP]
C48  0.1uF  CAP0402-CAP  [0402-CAP]
U4  HDC1000  [HDC1000]
U5  L3GD20H  [L3GD20H]
U7  MAG3110  [MAG3110]
U8  MMA8451Q  [MMA8451Q]
U9  SI7021  [SI7021]
U16  LPS25H  [LPS25H]

### Nets
GND: C18.2 C19.2 C20.2 C21.2 C24.2 U4.B2(GND) U5.P$4(I2C_SA0/SPI_SDO) U5.P$9(RESERVED) U5.P$10(RESERVED) U5.P$11(RESERVED) U5.P$12(GND) U5.P$13(GND) U5.P$15(RESERVED) U7.P$5(GND) U7.P$10(GND) U8.P$5(GND) U8.P$7(SA0) U8.P$10(GND) U8.P$12(GND) U9.P$2(GND) U16.P$3(GND) U16.P$5(I2C_SA0/SPI4_SDO) U16.P$8(GND) U16.P$9(GND)
I2C_SCL: U4.A1(SCL) U5.P$2(I2C_SCL/SPI_SPC) U7.P$7(SCL) U8.P$4(SCL) U9.P$6(SCL) U16.P$2(I2C_SCL/SPI_SPC)
I2C_SDA: U4.A2(SDA) U5.P$3(I2C_SDA/SPI_SDI/SPI3_SDO) U7.P$6(SDA) U8.P$6(SDA) U9.P$1(SDA) U16.P$4(I2C_SDA/SPI4_SDI/SPI3_SDIO)
N$1: C14.1 U8.P$2(BYP)
N$2: C14.2 ; supply symbol labelled GND
N$6: C46.2 C47.2 ; supply symbol labelled GND
N$11: U5.P$5(I2C_VS_SPI_MODE_SELECT) ; supply symbol labelled VCC
N$12: C15.2 C48.2 ; supply symbol labelled GND
N$13: C23.2 ; supply symbol labelled GND
N$14: C22.2 ; supply symbol labelled GND
N$17: C20.1 C21.1 U7.P$1(CAP_A) U7.P$4(CAP_R)
N$18: C38.2 C39.2 ; supply symbol labelled GND
N$27: C16.2 ; supply symbol labelled GND
N$28: C17.2 ; supply symbol labelled GND
VCC: C15.1 C16.1 C17.1 C18.1 C19.1 C22.1 C23.1 C24.1 C38.1 C39.1 C46.1 C47.1 C48.1 U4.B1(VDD) U4.C1(ADR0) U4.D1(ADR1) U5.P$1(VDD_IO) U5.P$14(CAP) U5.P$16(VDD) U7.P$2(VDD) U7.P$8(VDDIO) U8.P$1(VDDIO) U8.P$14(VDD) U9.P$5(VDD) U16.P$1(VDD_IO) U16.P$6(I2C_VS_SPI_MODE_SELECT/SPI_EN) U16.P$10(VDD)
Unconnected: U4.C2(DNC) U4.D2(!DRDY) U5.P$6(DRDY/INT2) U5.P$7(INT1) U5.P$8(DEN) U7.P$3(NC) U7.P$9(INT1) U8.P$3(NC) U8.P$8(NC) U8.P$9(INT2) U8.P$11(INT1) U8.P$13(NC) U8.P$15(NC) U8.P$16(NC) U9.P$3(DNC) U9.P$4(DNC) U16.P$7(INT1)

### Notes on the sheet
- I2C Address: 0x40
- I2C Address: 0x6A (SA0 -> GND)
- I2C Address: 0x1C (SA0 -> GND)
- I2C Address: 0x5C (I2C_SA0-> GND)
- I2C Address: 0x43 (ADR0/ADR1 --> VDD/VDD)
- I2C Address: 0x0E
- Sensors-2
- Warp revision C
- Authored 2015-2019
  Phillip Stanley-Marbell
  Richard Hopper
- NO WARRANTY. See LICENCE.txt

### Library data of the parts
C14-C24 C38 C39 C46-C48 = SparkFun-Passives:CAP: Capacitor Standard 0603 ceramic capacitor, and 0.1" leaded capacitor.
U4 = HDC1000:HDC1000: HDC1000 Low Power, High Accuracy Digital Humidity Sensor with Temperature Sensor.
U5 = L3GD20H:L3GD20H: L3GD20H MEMS motion sensor: three-axis digital output gyroscope.
U7 = MAG3110:MAG3110: MAG3110 Three-Axis, Digital Magnetometer.
U8 = MMA8451Q:MMA8451Q: MMA8451Q 3-Axis, 14-bit/8-bit Digital Accelerometer.
U9 = SI7021:SI7021: I2C HUMIDITY AND TEMPERATURE SENSOR.
U16 = LPS25H:LPS25H: LPS25H MEMS pressure sensor: 260-1260 hPa absolute digital output barometer

## Module RTC
Ports: GND(pwr) I2C_SCL(in) I2C_SDA(io) VCC(pwr) !INT(out)
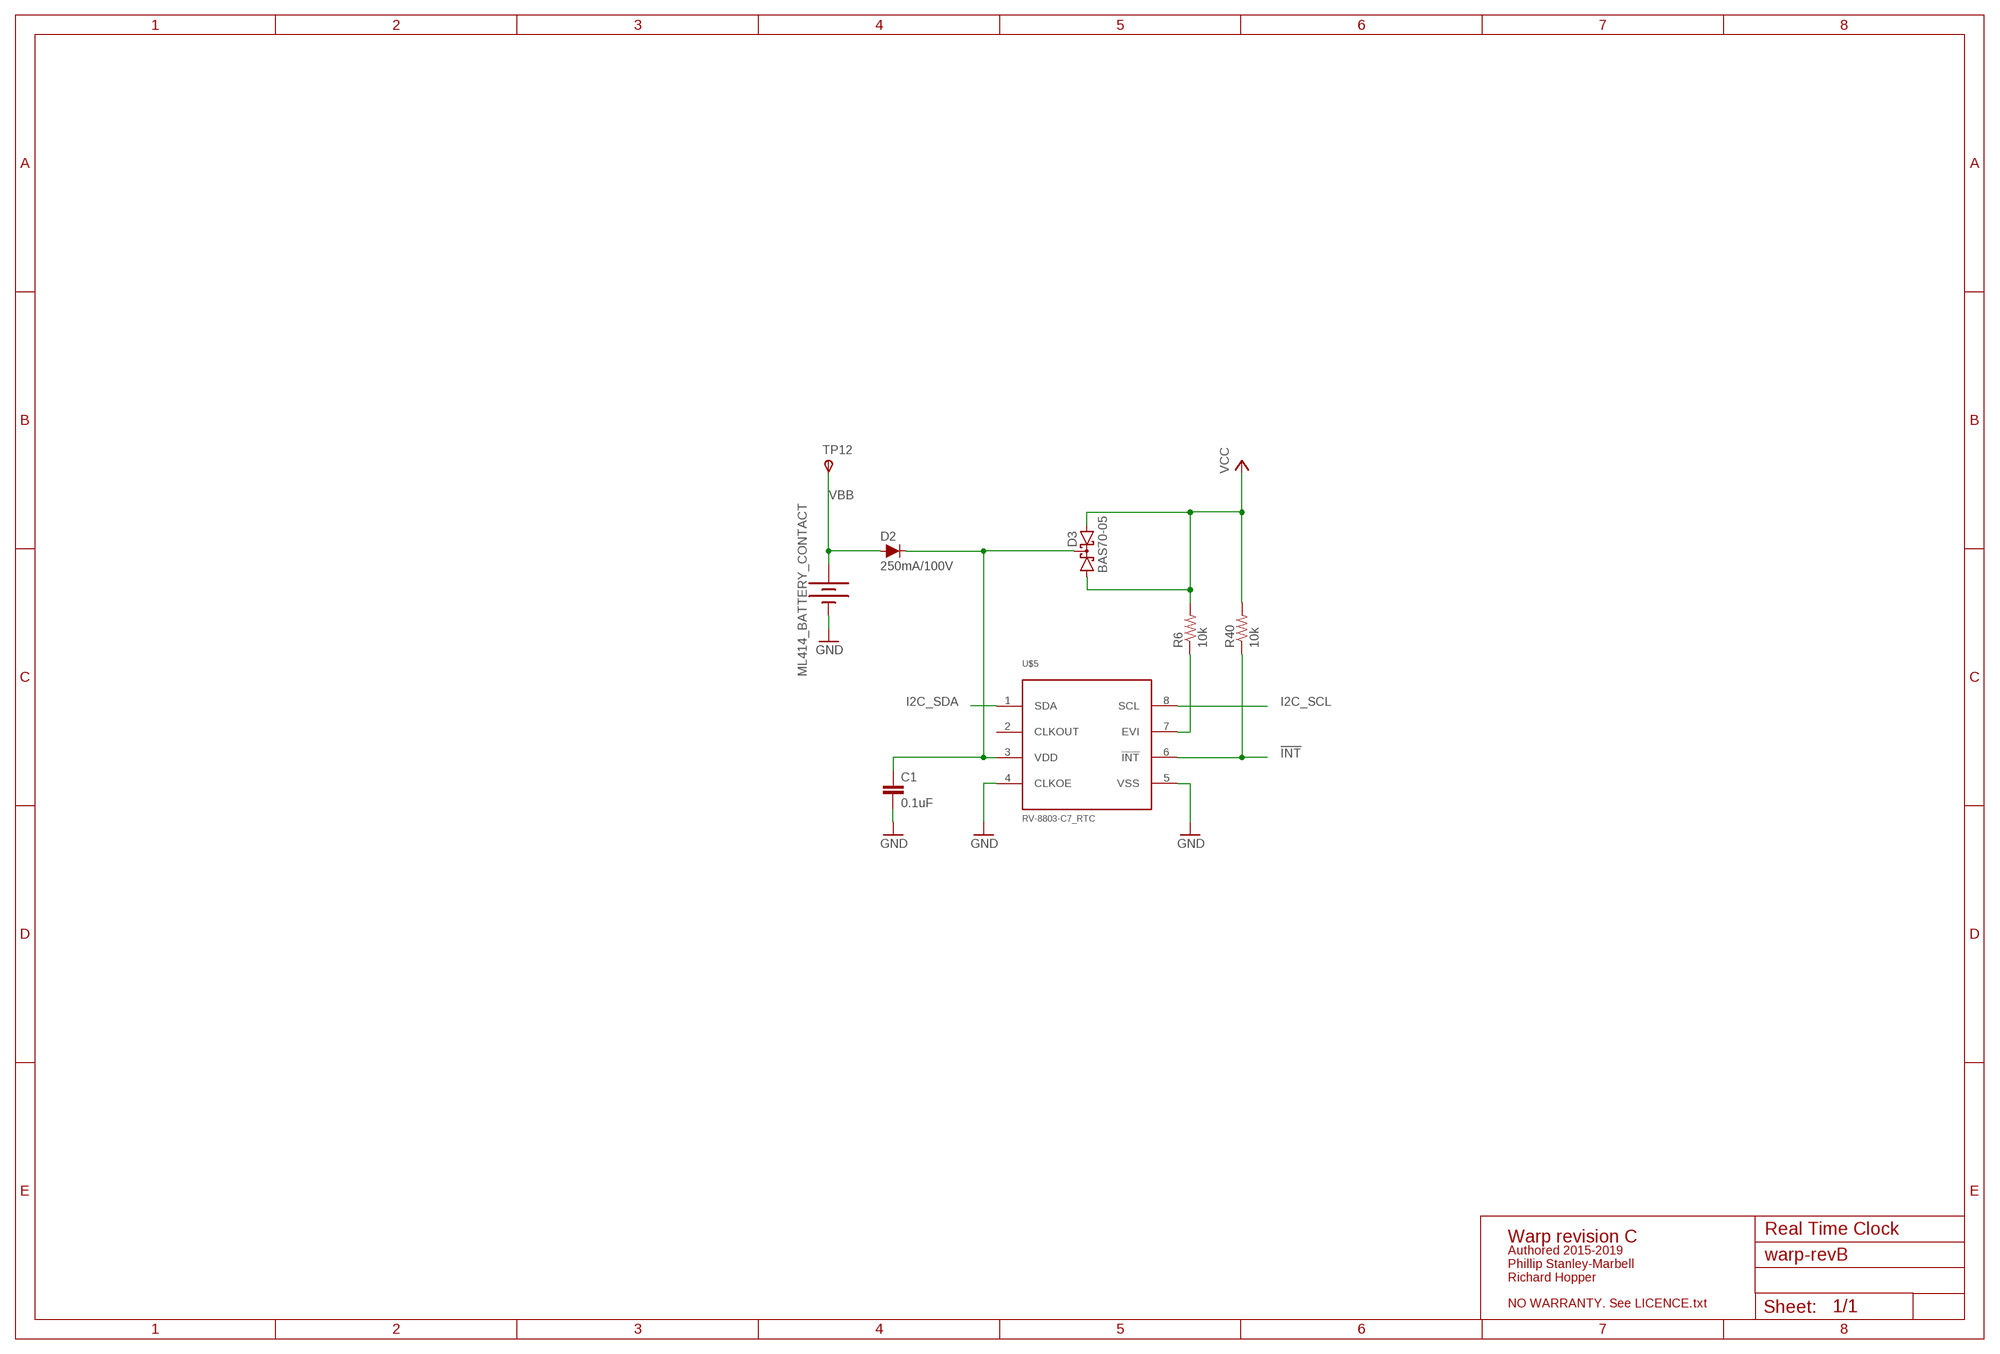
[diagram p11: schematic, module RTC, sheet 1]

### Parts
C1  0.1uF  CAP0603-CAP  [0603-CAP]
D2  250mA/100V  DIODE-BAS16J  [SOD-323]
D3  BAS70-05  [SOT23]
R6  10k  RESISTOR0402-RES  [0402-RES]
R40  10k  RESISTOR0402-RES  [0402-RES]
TP12  TPSTP06R  [TP06R]
U$5  RV-8803-C7_RTC  [RV-C7]
U$6  ML414_BATTERY_CONTACT  [ML414]

### Nets
!INT: R40.1 U$5.6(!INT!)
GND: C1.2 U$5.4(CLKOE) U$5.5(VSS) U$6.2(-)
I2C_SCL: U$5.8(SCL)
I2C_SDA: U$5.1(SDA)
N$1: C1.1 D2.C D3.3(C) U$5.3(VDD)
N$3: R6.1 U$5.7(EVI)
VBB: D2.A TP12.TP(PP) U$6.1(+) U$6.3(+)
VCC: D3.1(A1) D3.2(A2) R6.2 R40.2
Unconnected: U$5.2(CLKOUT)

### Notes on the sheet
- Real Time Clock
- Warp revision C
- Authored 2015-2019
  Phillip Stanley-Marbell
  Richard Hopper
- NO WARRANTY. See LICENCE.txt

### Library data of the parts
C1 = SparkFun-Passives:CAP: Capacitor Standard 0603 ceramic capacitor, and 0.1" leaded capacitor.
D2 = SparkFun-DiscreteSemi:DIODE: Diode These are standard reverse protection diodes and small signal diodes. SparkFun Products: SparkFun SparkPunk Sound Kit <https://www.sparkfun.com/products/11177> SparkFun ESP8266 Thing <https://www.sparkfun.com/products/13231>; PROD_ID: DIO-09646
D3 = diode:BAS70-05: Silicon Schottky Diodes General-purpose diode for high-speed switching
R6 R40 = SparkFun-Passives:RESISTOR: Resistor Basic schematic elements and footprints for 0603, 1206, and PTH resistors.
TP12 = testpad:TPS: TEST PIN
U$5 = Micro Crystal RTC:RV-8803-C7_RTC
U$6 = ML414:ML414_BATTERY_CONTACT: ML414 Battery Contact

## Module CHARGER
Ports: GND(pwr) IN(pwr) OUT(pwr) BAT(pwr)
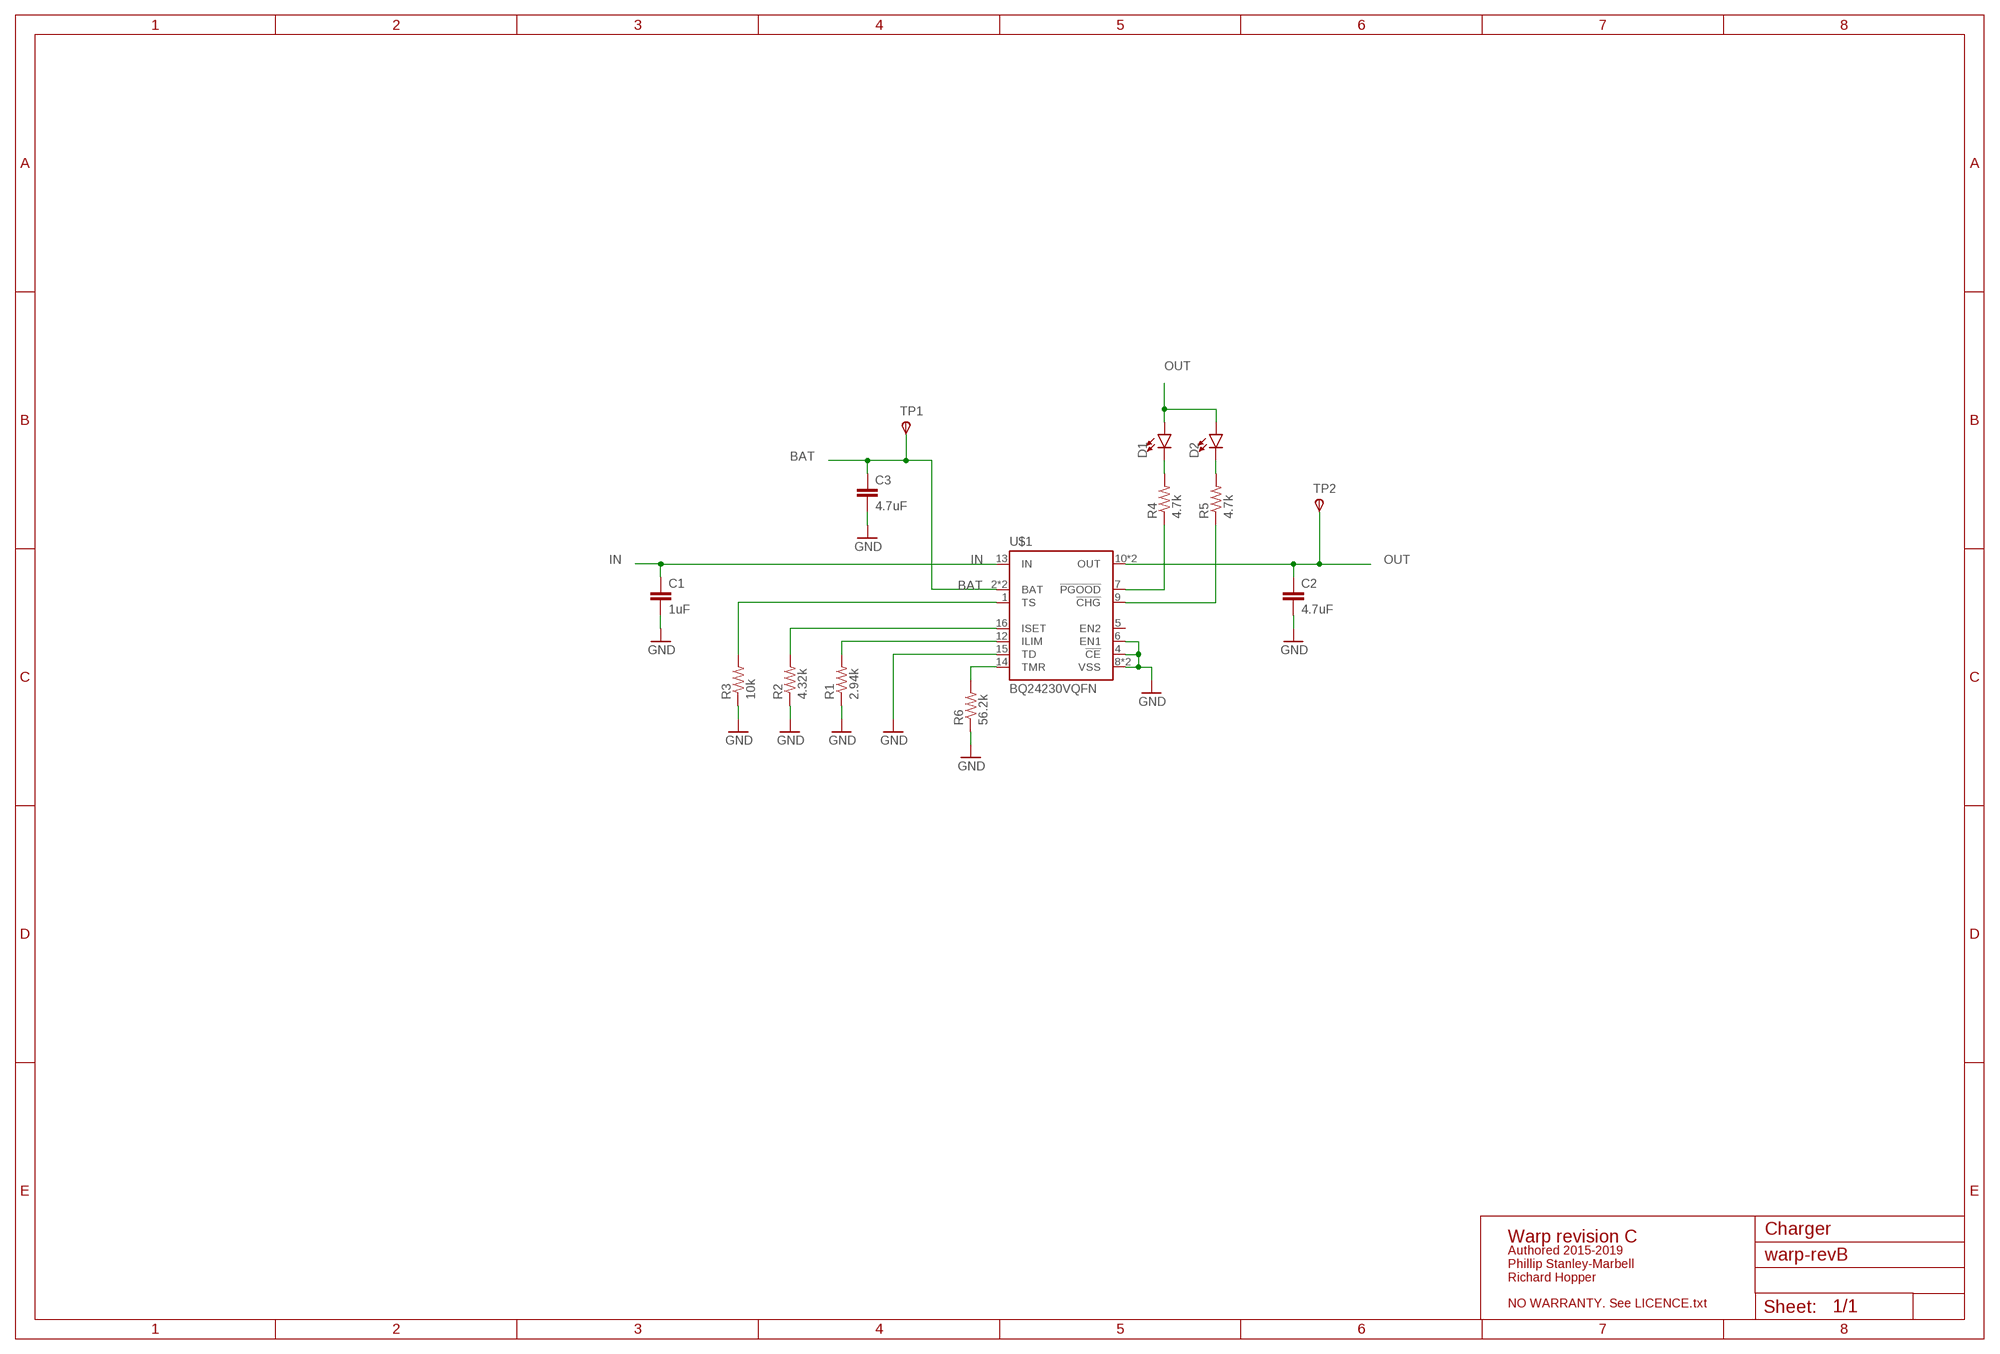
[diagram p12: schematic, module CHARGER, sheet 1]

### Parts
C1  1uF  CAP0805  [0805]
C2  4.7uF  CAP0805  [0805]
C3  4.7uF  CAP0805  [0805]
D1  LED0603  [LED-0603]
D2  LED0603  [LED-0603]
R1  2.94k  RESISTOR0402-RES  [0402-RES]
R2  4.32k  RESISTOR0402-RES  [0402-RES]
R3  10k  RESISTOR0402-RES  [0402-RES]
R4  4.7k  RESISTOR0402-RES  [0402-RES]
R5  4.7k  RESISTOR0402-RES  [0402-RES]
R6  56.2k  RESISTOR0402-RES  [0402-RES]
TP1  TPSTP06R  [TP06R]
TP2  TPSTP06R  [TP06R]
U$1  BQ24230VQFN  [PVQFN-N16]

### Nets
BAT: C3.1 TP1.TP(PP) U$1.2(BAT) U$1.3(BAT)
GND: C1.2 C2.2 C3.2 R1.1 R2.1 R3.1 R6.1 U$1.4(!CE!) U$1.6(EN1) U$1.8(VSS) U$1.15(TD) U$1.EP(VSS)
IN: C1.1 U$1.13(IN)
N$1: R2.2 U$1.16(ISET)
N$2: R1.2 U$1.12(ILIM)
N$3: R4.1 U$1.7(!PGOOD!)
N$4: R3.2 U$1.1(TS)
N$5: R5.1 U$1.9(!CHG!)
N$6: D1.C R4.2
N$7: D2.C R5.2
N$8: R6.2 U$1.14(TMR)
OUT: C2.1 D1.A D2.A TP2.TP(PP) U$1.10(OUT) U$1.11(OUT)
Unconnected: U$1.5(EN2)

### Notes on the sheet
- Charger
- Warp revision C
- Authored 2015-2019
  Phillip Stanley-Marbell
  Richard Hopper
- NO WARRANTY. See LICENCE.txt

### Library data of the parts
C1-C3 = SparkFun-Passives:CAP: Capacitor Standard 0603 ceramic capacitor, and 0.1" leaded capacitor.
D1 D2 = SparkFun-LED:LED: LED (Generic) Standard schematic elements and footprints for 5mm, 3mm, 1206, and 0603 sized LEDs. Generic LEDs with no color specified.
R1-R6 = SparkFun-Passives:RESISTOR: Resistor Basic schematic elements and footprints for 0603, 1206, and PTH resistors.
TP1 TP2 = testpad:TPS: TEST PIN
U$1 = BQ24230:BQ24230: bq2423x USB-Friendly Lithium-Ion Battery Charger And Power-Path Management IC

## Module DF40_SOCKETS
Ports: 
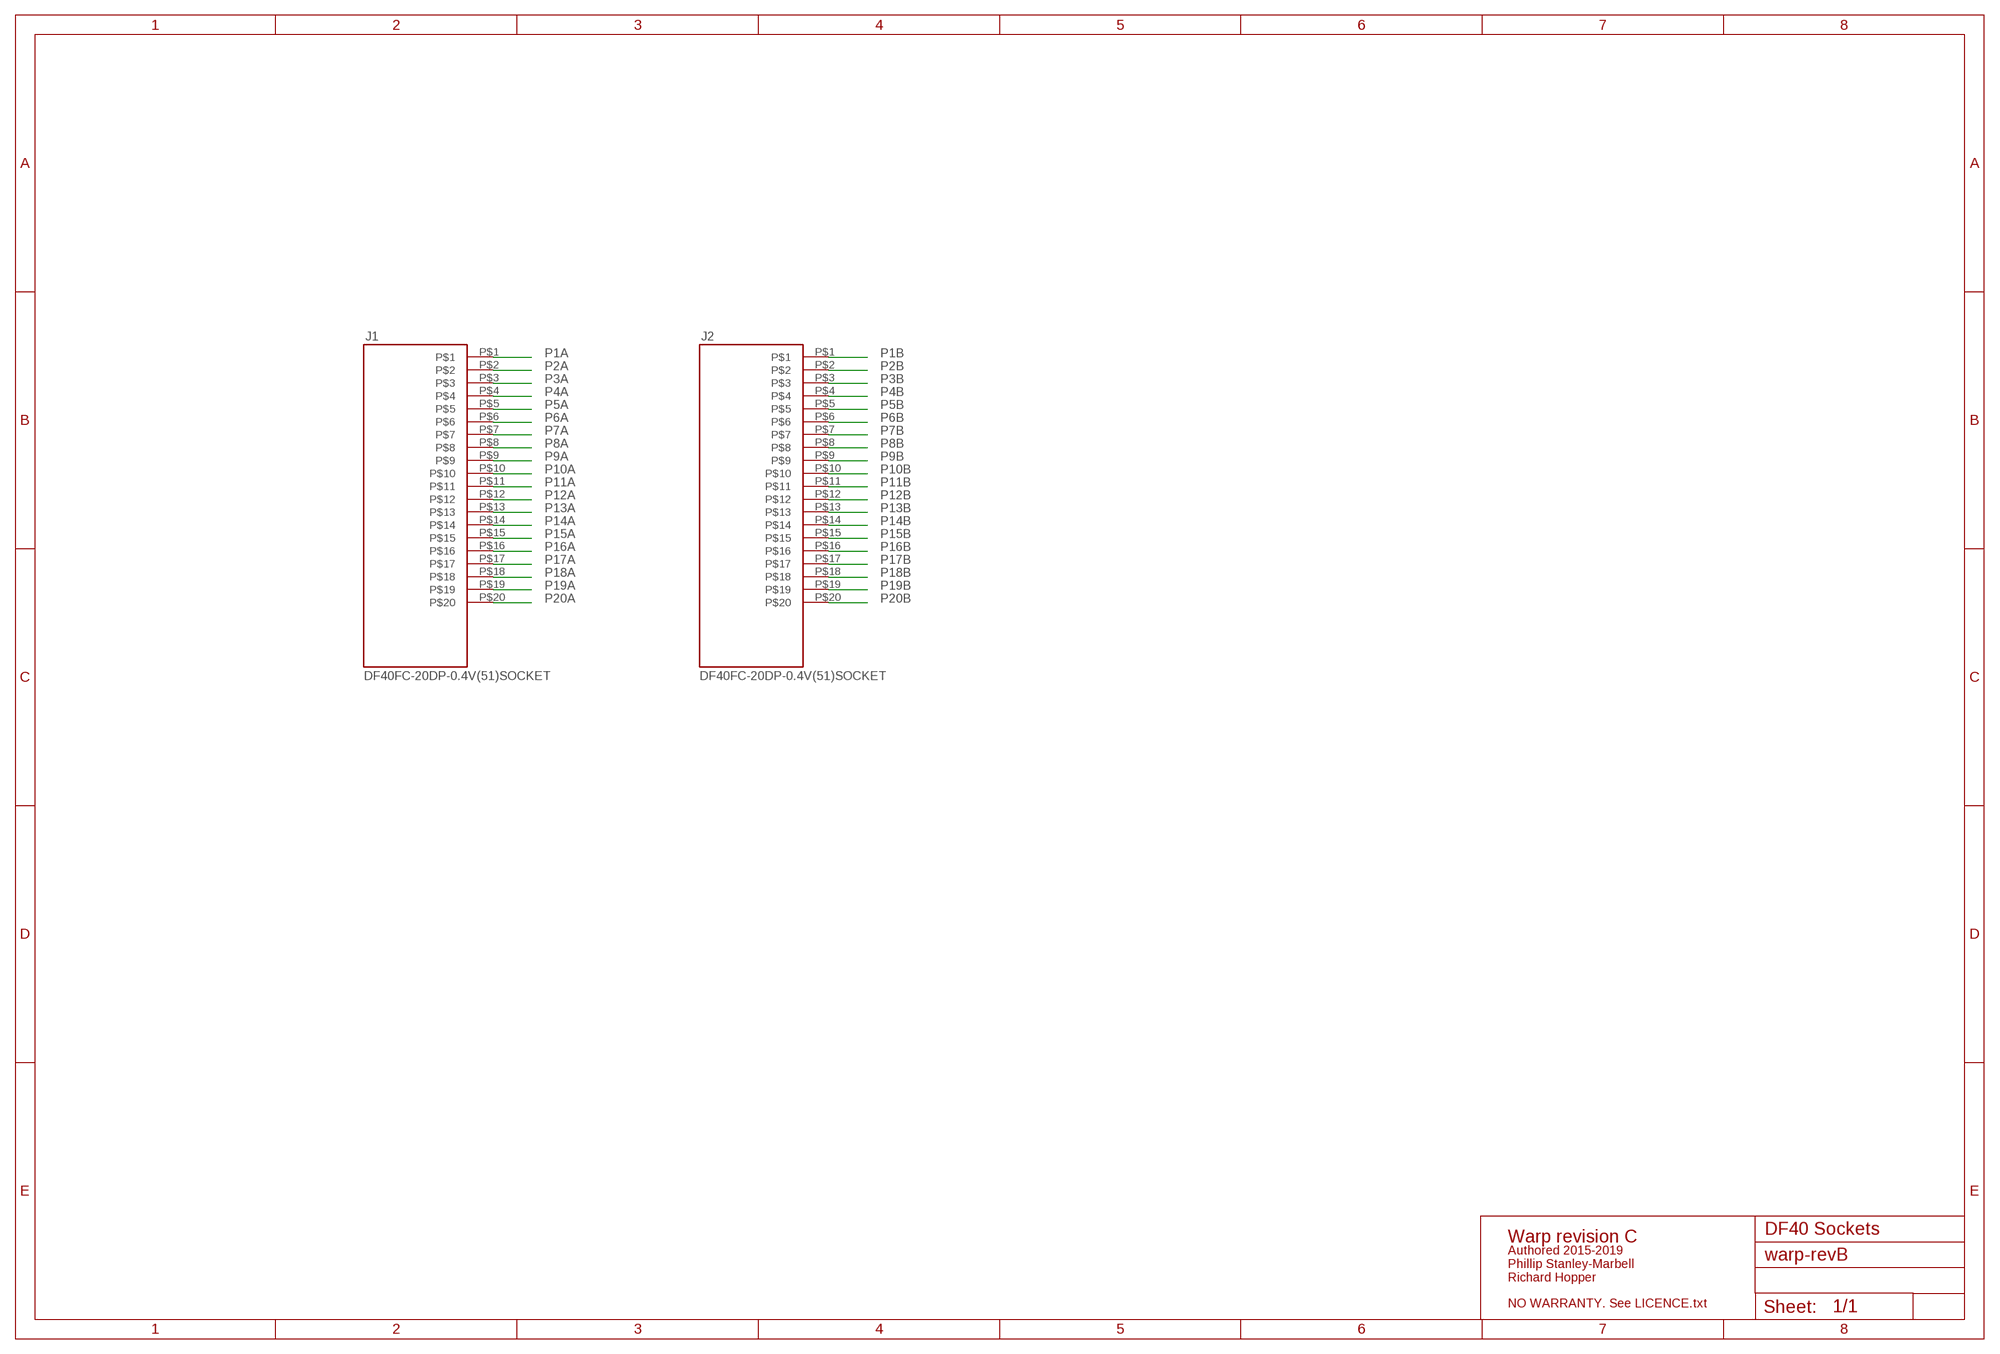
[diagram p13: schematic, module DF40_SOCKETS, sheet 1]

### Parts
J1  DF40FC-20DP-0.4V(51)SOCKET  [DF40C-20DP-0.4V(51)]
J2  DF40FC-20DP-0.4V(51)SOCKET  [DF40C-20DP-0.4V(51)]

### Nets
P1A: J1.P$1
P1B: J2.P$1
P2A: J1.P$2
P2B: J2.P$2
P3A: J1.P$3
P3B: J2.P$3
P4A: J1.P$4
P4B: J2.P$4
P5A: J1.P$5
P5B: J2.P$5
P6A: J1.P$6
P6B: J2.P$6
P7A: J1.P$7
P7B: J2.P$7
P8A: J1.P$8
P8B: J2.P$8
P9A: J1.P$9
P9B: J2.P$9
P10A: J1.P$10
P10B: J2.P$10
P11A: J1.P$11
P11B: J2.P$11
P12A: J1.P$12
P12B: J2.P$12
P13A: J1.P$13
P13B: J2.P$13
P14A: J1.P$14
P14B: J2.P$14
P15A: J1.P$15
P15B: J2.P$15
P16A: J1.P$16
P16B: J2.P$16
P17A: J1.P$17
P17B: J2.P$17
P18A: J1.P$18
P18B: J2.P$18
P19A: J1.P$19
P19B: J2.P$19
P20A: J1.P$20
P20B: J2.P$20

### Notes on the sheet
- DF40 Sockets
- Warp revision C
- Authored 2015-2019
  Phillip Stanley-Marbell
  Richard Hopper
- NO WARRANTY. See LICENCE.txt

### Library data of the parts
J1 J2 = DF40C-20DS-0.4V(51):DF40FC-20DP-0.4V(51): DF40C-20DS-0.4V(51)